# EAGLE design airball_display_board_v2 (EAGLE 9.6.2)
REV: 1

## Sheet 1 of 5
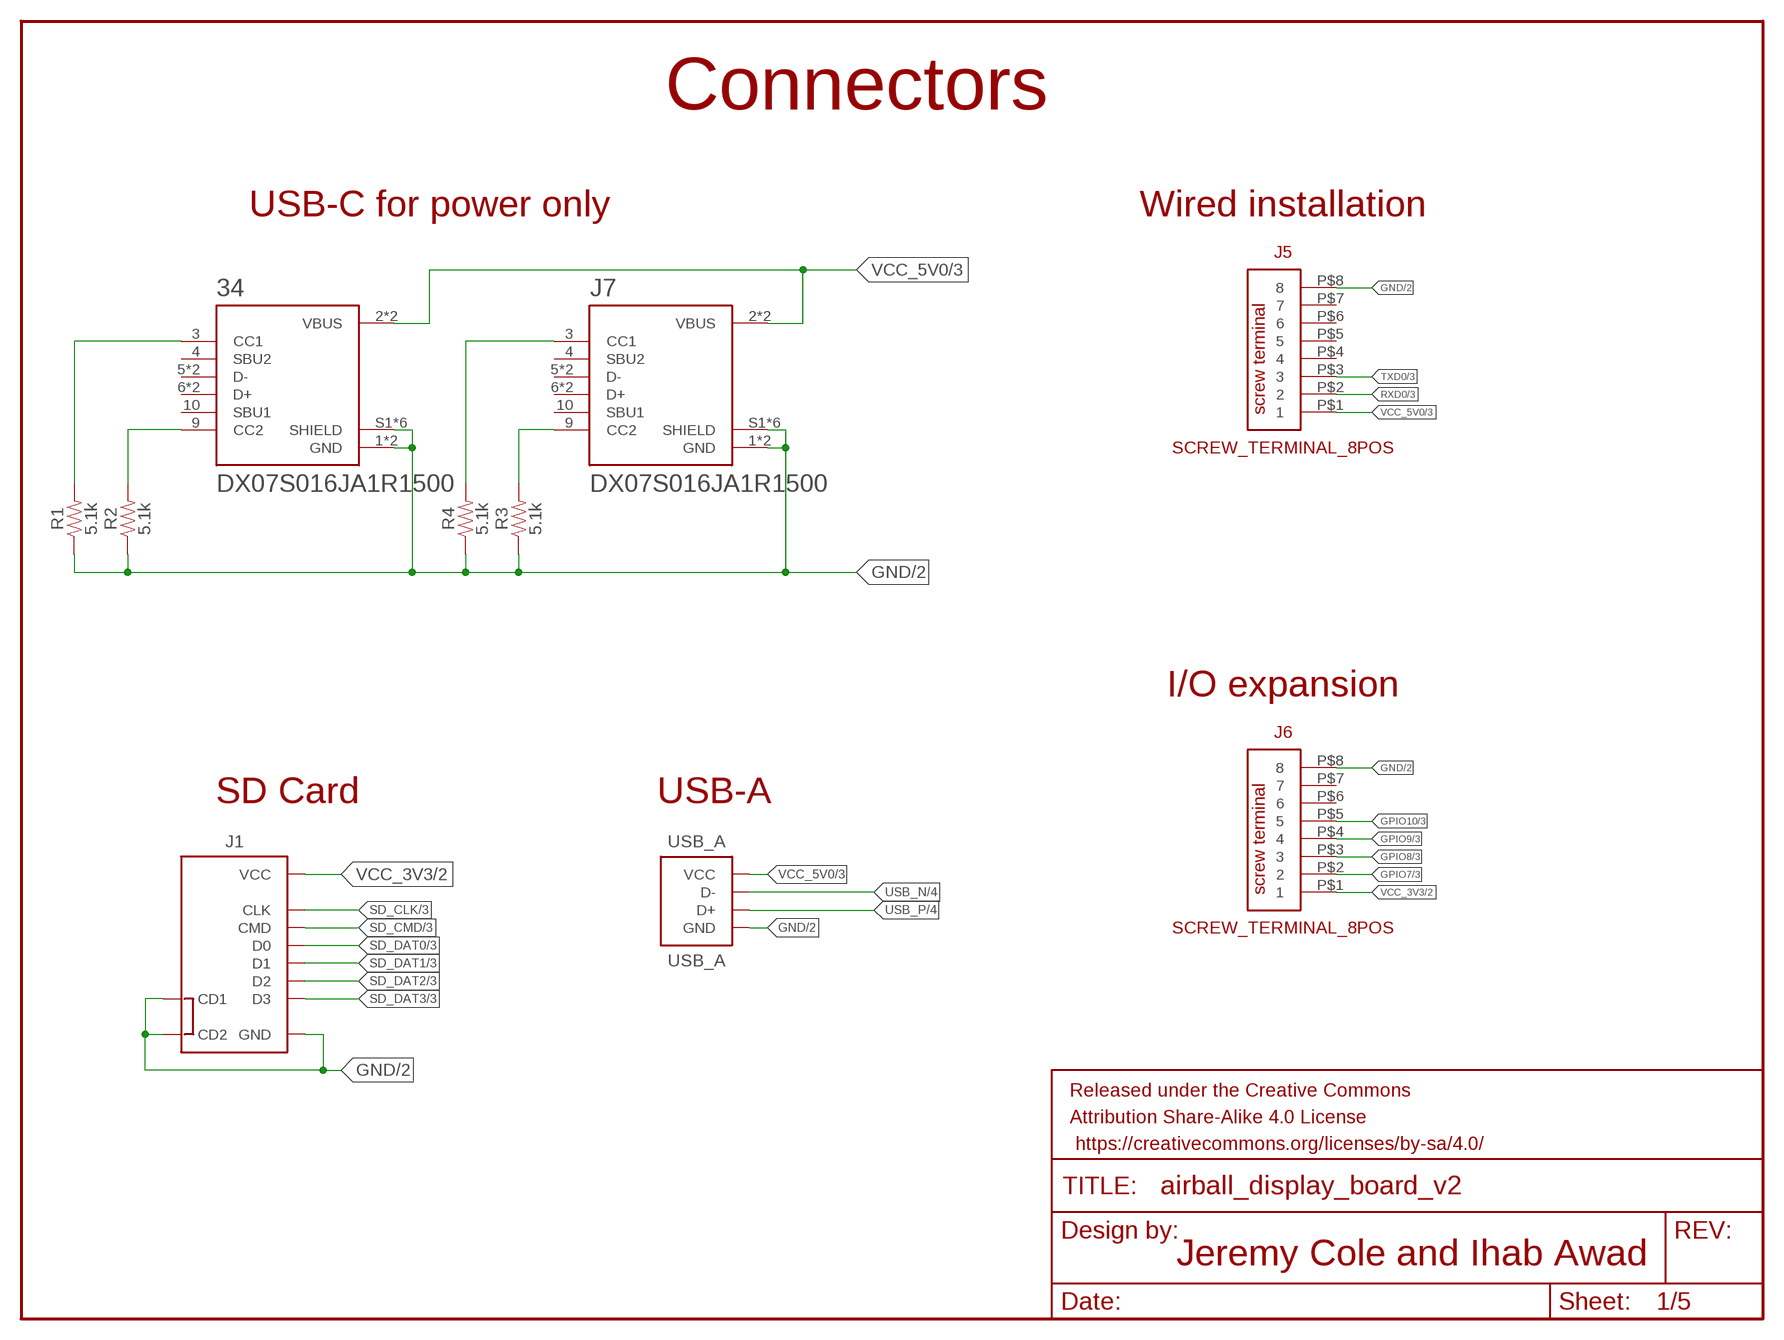
[diagram p0: schematic, sheet 1]

### Parts
34  DX07S016JA1R1500  [JAE_DX07S016JA1R1500]
FRAME1  FRAME-LETTER  [CREATIVE_COMMONS]
J1  MICRO-SD-SD4-MOLEX_104031  [MOLEX_MICRO_SD_104031]
J5  SCREW_TERMINAL_8POS  [SCREW_TERMINAL_8POS]
J6  SCREW_TERMINAL_8POS  [SCREW_TERMINAL_8POS]
J7  DX07S016JA1R1500  [JAE_DX07S016JA1R1500]
R1  5.1k  5.1KOHM5.1KOHM-0603-1/10W-1%  [0603]
R2  5.1k  5.1KOHM5.1KOHM-0603-1/10W-1%  [0603]
R3  5.1k  5.1KOHM5.1KOHM-0603-1/10W-1%  [0603]
R4  5.1k  5.1KOHM5.1KOHM-0603-1/10W-1%  [0603]
USB_A  USB_A  [FCI_USB_A_87583]

### Nets
GND: 34.1(GND) 34.12(GND) 34.S1(SHIELD) 34.S2(SHIELD) 34.S3(SHIELD) 34.S4(SHIELD) 34.S5(SHIELD) 34.S6(SHIELD) J1.6(GND) J1.CD1 J1.CD2 J1.SH@1(GND) J1.SH@2(GND) J1.SH@3(GND) J1.SH@4(GND) J5.P$8 J6.P$8 J7.1(GND) J7.12(GND) J7.S1(SHIELD) J7.S2(SHIELD) J7.S3(SHIELD) J7.S4(SHIELD) J7.S5(SHIELD) J7.S6(SHIELD) R1.1 R2.1 R3.1 R4.1 USB_A.GND USB_A.SH@1(GND) USB_A.SH@2(GND) ; also sheet 2,3,4,5
GPIO7: J6.P$2 ; also sheet 3
GPIO8: J6.P$3 ; also sheet 3
GPIO9: J6.P$4 ; also sheet 3
GPIO10: J6.P$5 ; also sheet 3
N$1: 34.9(CC2) R2.2
N$2: 34.3(CC1) R1.2
N$3: J7.9(CC2) R3.2
N$4: J7.3(CC1) R4.2
RXD0: J5.P$2 ; also sheet 3
SD_CLK: J1.5(CLK) ; also sheet 3
SD_CMD: J1.3(CMD) ; also sheet 3
SD_DAT0: J1.7(D0) ; also sheet 3
SD_DAT1: J1.8(D1) ; also sheet 3
SD_DAT2: J1.1(D2) ; also sheet 3
SD_DAT3: J1.2(D3) ; also sheet 3
TXD0: J5.P$3 ; also sheet 3
USB_N: USB_A.D- ; also sheet 4
USB_P: USB_A.D+ ; also sheet 4
VCC_3V3: J1.4(VCC) J6.P$1 ; also sheet 2,3,5
VCC_5V0 [vcc_5v0]: 34.2(VBUS) 34.11(VBUS) J5.P$1 J7.2(VBUS) J7.11(VBUS) USB_A.VBUS(VCC) ; also sheet 3,5
Unconnected: 34.4(SBU2) 34.5(D-) 34.6(D+) 34.7(D+) 34.8(D-) 34.10(SBU1) J5.P$4 J5.P$5 J5.P$6 J5.P$7 J6.P$6 J6.P$7 J7.4(SBU2) J7.5(D-) J7.6(D+) J7.7(D+) J7.8(D-) J7.10(SBU1)

### Notes on the sheet
- Connectors
- USB-C for power only | Wired installation
- I/O expansion
- SD Card | USB-A
- Jeremy Cole and Ihab Awad

## Sheet 2 of 5
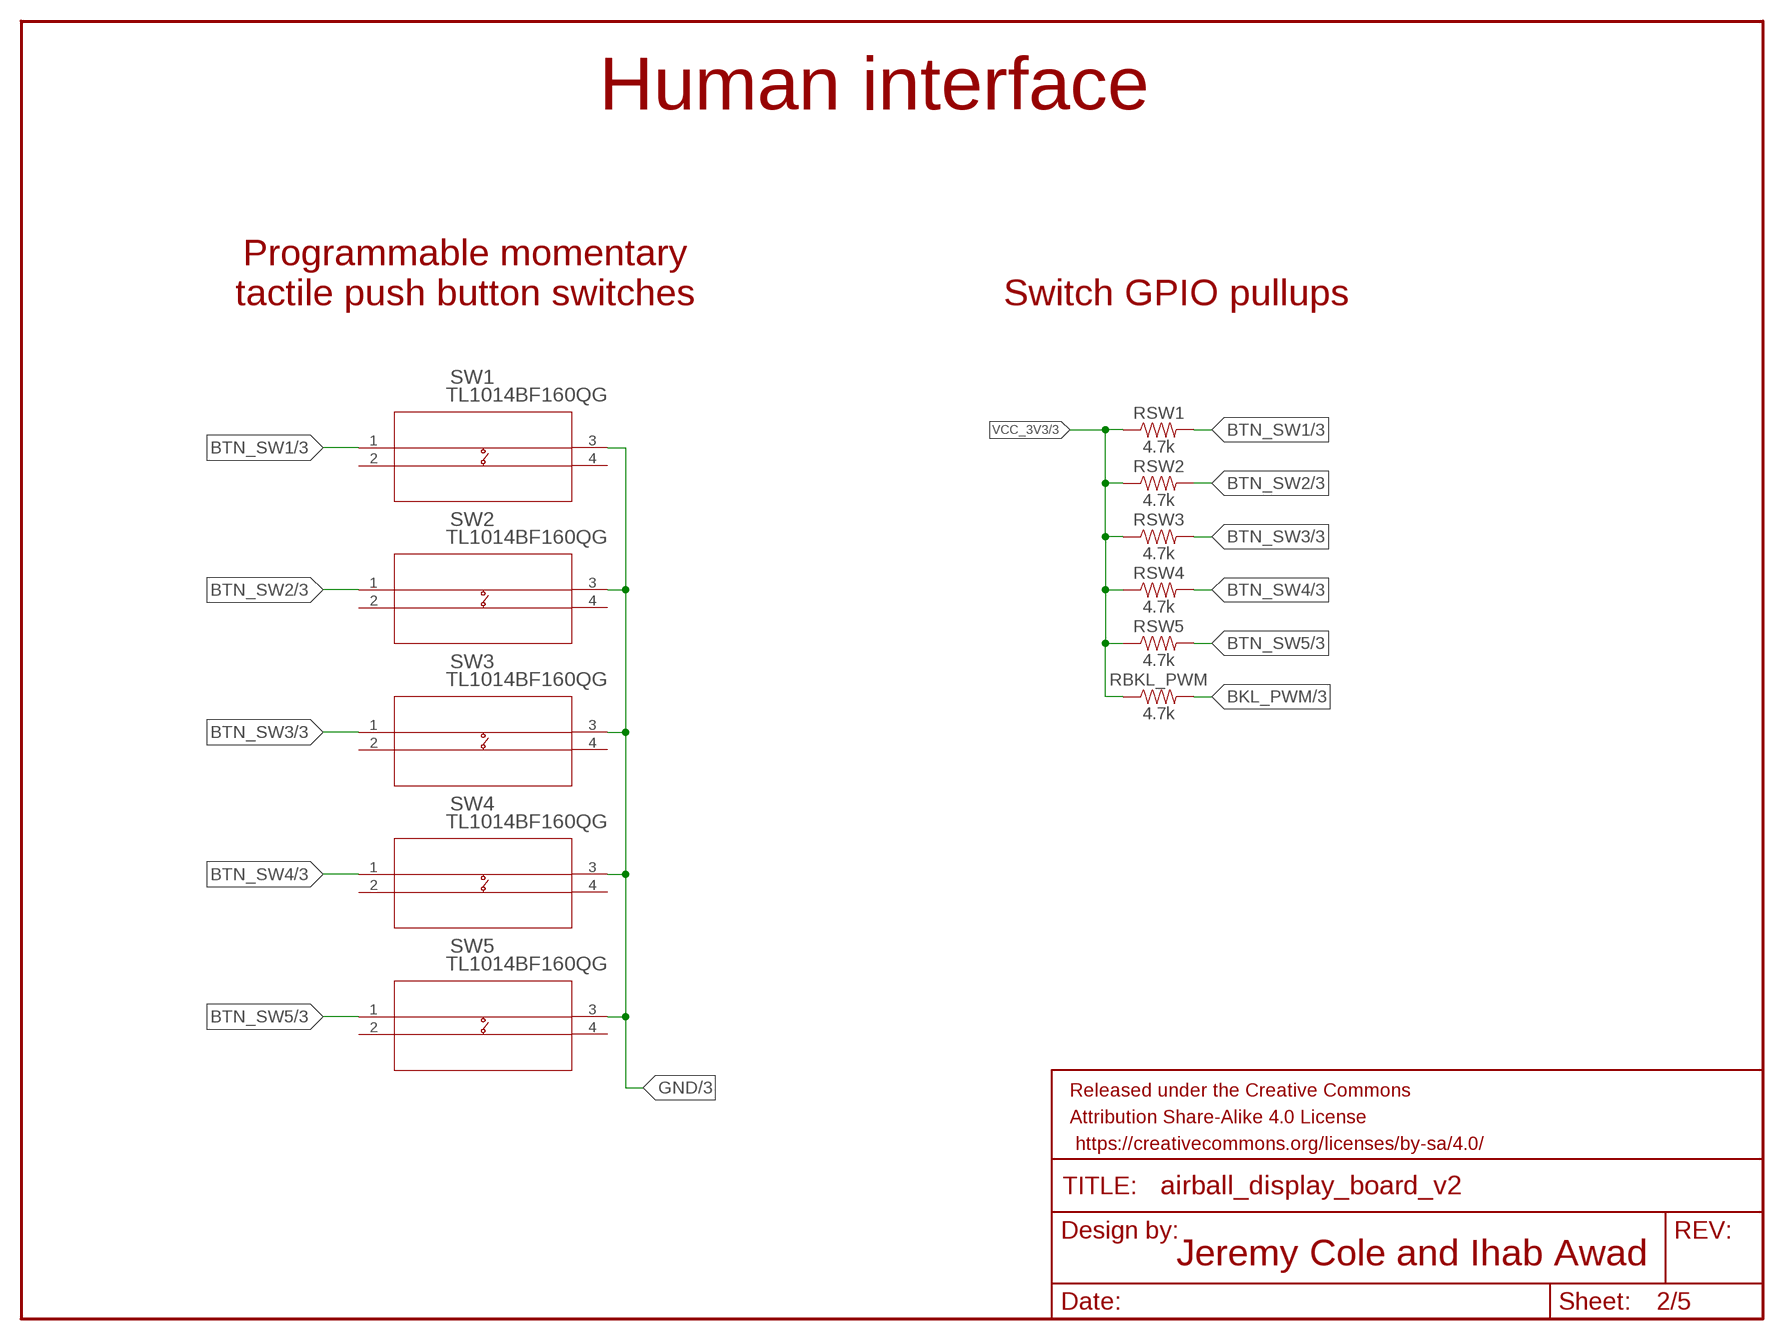
[diagram p1: schematic, sheet 2]

### Parts
FRAME4  FRAME-LETTER  [CREATIVE_COMMONS]
RBKL_PWM  4.7k  4.7KOHM-0603-1/10W-1%  [0603]
RSW1  4.7k  4.7KOHM-0603-1/10W-1%  [0603]
RSW2  4.7k  4.7KOHM-0603-1/10W-1%  [0603]
RSW3  4.7k  4.7KOHM-0603-1/10W-1%  [0603]
RSW4  4.7k  4.7KOHM-0603-1/10W-1%  [0603]
RSW5  4.7k  4.7KOHM-0603-1/10W-1%  [0603]
SW1  TL1014BF160QG  [TL1014BF160QG_EWI]
SW2  TL1014BF160QG  [TL1014BF160QG_EWI]
SW3  TL1014BF160QG  [TL1014BF160QG_EWI]
SW4  TL1014BF160QG  [TL1014BF160QG_EWI]
SW5  TL1014BF160QG  [TL1014BF160QG_EWI]

### Nets
BKL_PWM: RBKL_PWM.2 ; also sheet 3,5
BTN_SW1: RSW1.2 SW1.1 ; also sheet 3
BTN_SW2: RSW2.2 SW2.1 ; also sheet 3
BTN_SW3: RSW3.2 SW3.1 ; also sheet 3
BTN_SW4: RSW4.2 SW4.1 ; also sheet 3
BTN_SW5: RSW5.2 SW5.1 ; also sheet 3
GND: SW1.3 SW2.3 SW3.3 SW4.3 SW5.3 ; also sheet 1,3,4,5
VCC_3V3: RBKL_PWM.1 RSW1.1 RSW2.1 RSW3.1 RSW4.1 RSW5.1 ; also sheet 1,3,5
Unconnected: SW1.2 SW1.4 SW2.2 SW2.4 SW3.2 SW3.4 SW4.2 SW4.4 SW5.2 SW5.4

### Notes on the sheet
- Human interface
- Programmable momentary
  tactile push button switches
- Switch GPIO pullups
- Jeremy Cole and Ihab Awad

## Sheet 3 of 5
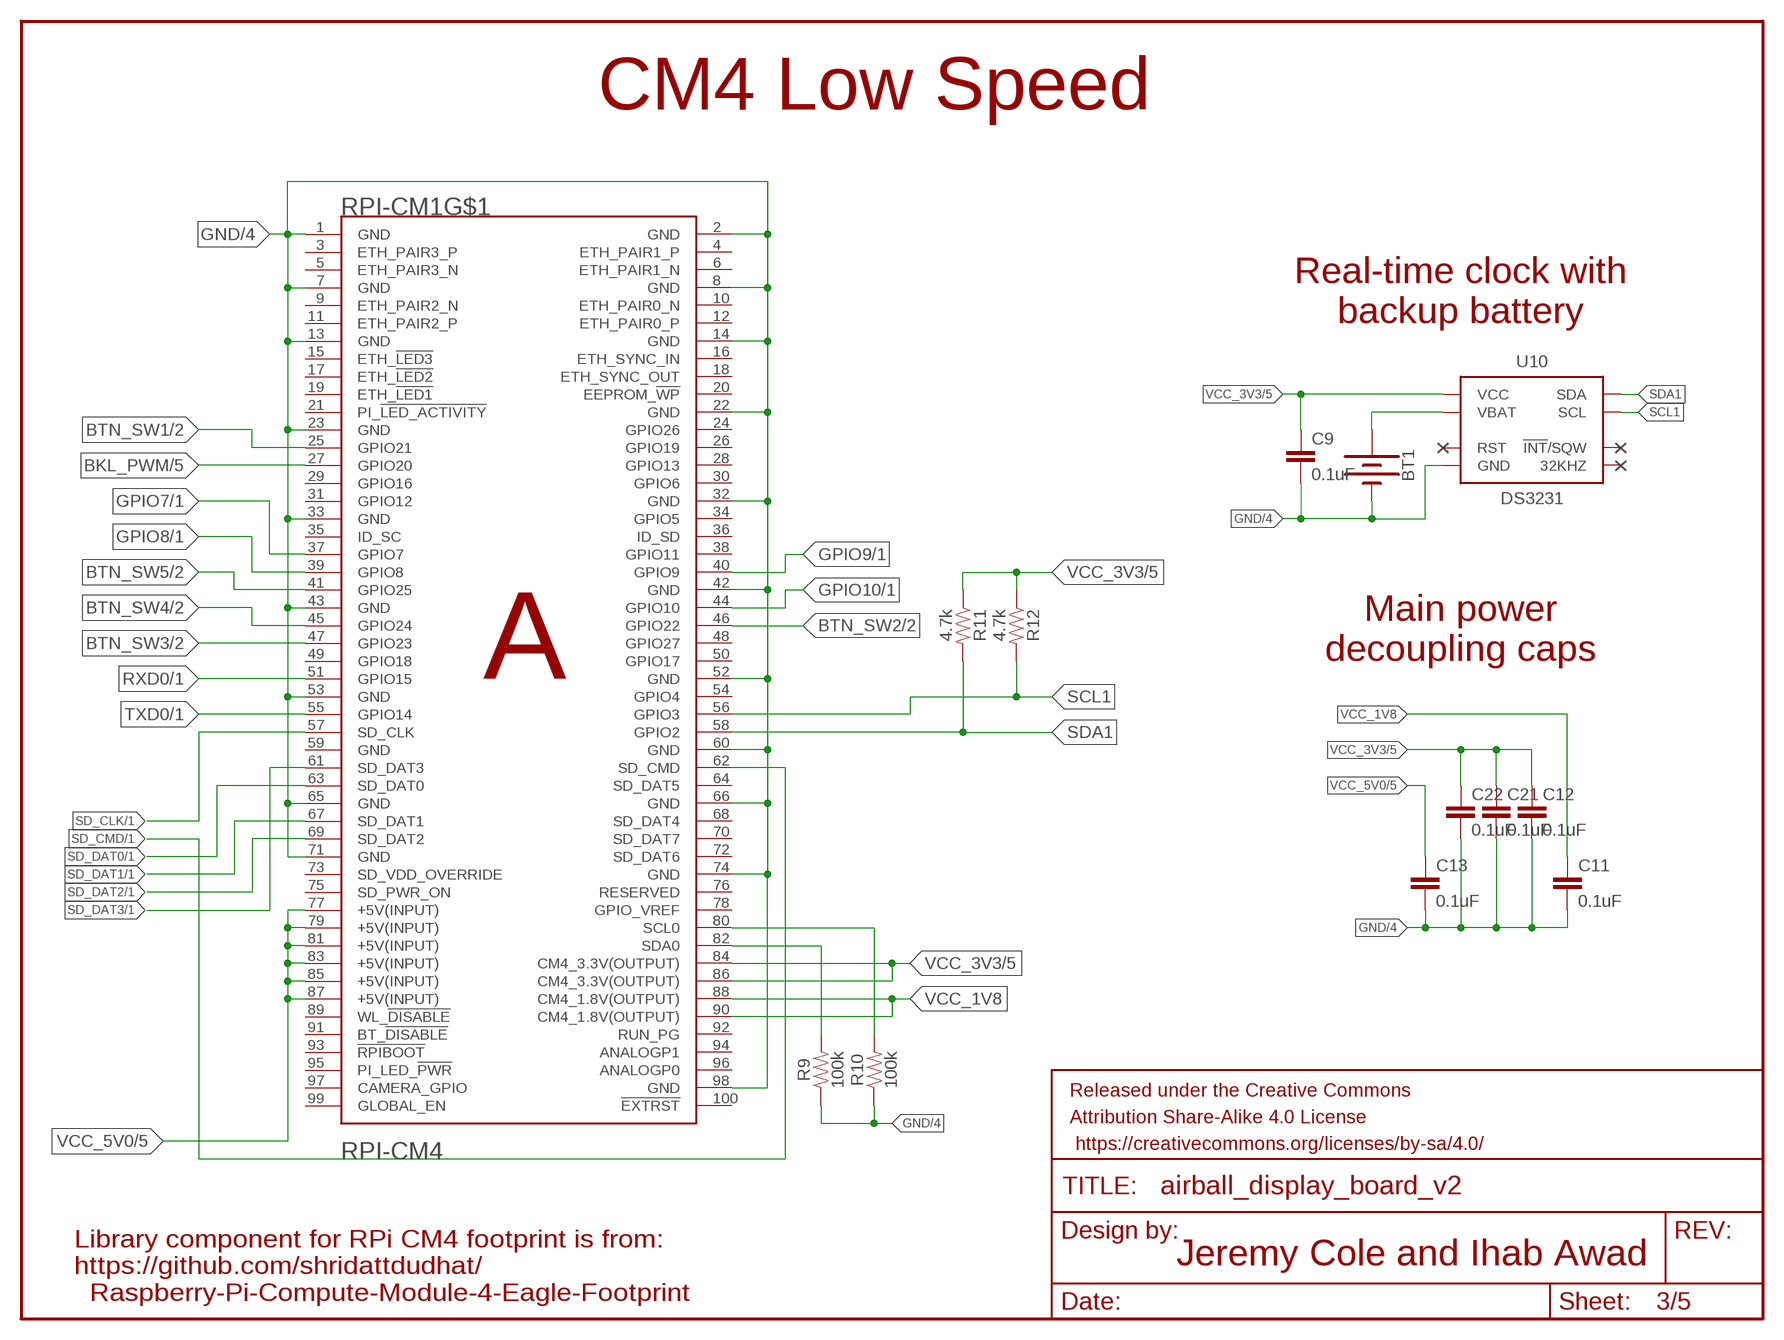
[diagram p2: schematic, sheet 3]

### Parts
BT1  BATTERY-12MM_SMD  [BATTCON_12MM]
C9  0.1uF  0.1UF-0603-25V-5%  [0603]
C11  0.1uF  0.1UF-0603-25V-5%  [0603]
C12  0.1uF  0.1UF-0603-25V-5%  [0603]
C13  0.1uF  0.1UF-0603-25V-5%  [0603]
C21  0.1uF  0.1UF-0603-25V-5%  [0603]
C22  0.1uF  0.1UF-0603-25V-5%  [0603]
FRAME2  FRAME-LETTER  [CREATIVE_COMMONS]
R9  100k  100KOHM-0603-1/10W-1%  [0603]
R10  100k  100KOHM-0603-1/10W-1%  [0603]
R11  4.7k  4.7KOHM-0603-1/10W-1%  [0603]
R12  4.7k  4.7KOHM-0603-1/10W-1%  [0603]
RPI-CM1  RPI-CM4  [RPI-CM4]
U10  DS3231  [SOIC16W]

### Nets
BKL_PWM: RPI-CM1.27(GPIO20) ; also sheet 2,5
BTN_SW1: RPI-CM1.25(GPIO21) ; also sheet 2
BTN_SW2: RPI-CM1.46(GPIO22) ; also sheet 2
BTN_SW3: RPI-CM1.47(GPIO23) ; also sheet 2
BTN_SW4: RPI-CM1.45(GPIO24) ; also sheet 2
BTN_SW5: RPI-CM1.41(GPIO25) ; also sheet 2
GND: BT1.GND(-) C9.2 C11.2 C12.2 C13.2 C21.2 C22.2 R9.1 R10.1 RPI-CM1.1(GND) RPI-CM1.2(GND) RPI-CM1.7(GND) RPI-CM1.8(GND) RPI-CM1.13(GND) RPI-CM1.14(GND) RPI-CM1.22(GND) RPI-CM1.23(GND) RPI-CM1.32(GND) RPI-CM1.33(GND) RPI-CM1.42(GND) RPI-CM1.43(GND) RPI-CM1.52(GND) RPI-CM1.53(GND) RPI-CM1.60(GND) RPI-CM1.65(GND) RPI-CM1.66(GND) RPI-CM1.71(GND) RPI-CM1.74(GND) RPI-CM1.98(GND) U10.5(GND) U10.6(GND) U10.7(GND) U10.8(GND) U10.9(GND) U10.10(GND) U10.11(GND) U10.12(GND) U10.13(GND) ; also sheet 1,2,4,5
GPIO7: RPI-CM1.37(GPIO7) ; also sheet 1
GPIO8: RPI-CM1.39(GPIO8) ; also sheet 1
GPIO9: RPI-CM1.40(GPIO9) ; also sheet 1
GPIO10: RPI-CM1.44(GPIO10) ; also sheet 1
RTC_VBAT: BT1.PWR@1(+) U10.14(VBAT)
RXD0: RPI-CM1.51(GPIO15) ; also sheet 1
SCL0: R10.2 RPI-CM1.80(SCL0)
SCL1: R12.2 RPI-CM1.56(GPIO3) U10.16(SCL)
SD_CLK: RPI-CM1.57(SD_CLK) ; also sheet 1
SD_CMD: RPI-CM1.62(SD_CMD) ; also sheet 1
SD_DAT0: RPI-CM1.63(SD_DAT0) ; also sheet 1
SD_DAT1: RPI-CM1.67(SD_DAT1) ; also sheet 1
SD_DAT2: RPI-CM1.69(SD_DAT2) ; also sheet 1
SD_DAT3: RPI-CM1.61(SD_DAT3) ; also sheet 1
SDA0: R9.2 RPI-CM1.82(SDA0)
SDA1: R11.2 RPI-CM1.58(GPIO2) U10.15(SDA)
TXD0: RPI-CM1.55(GPIO14) ; also sheet 1
VCC_1V8: C11.1 RPI-CM1.88(CM4_1.8V(OUTPUT)) RPI-CM1.90(CM4_1.8V(OUTPUT))
VCC_3V3: C9.1 C12.1 C21.1 C22.1 R11.1 R12.1 RPI-CM1.84(CM4_3.3V(OUTPUT)) RPI-CM1.86(CM4_3.3V(OUTPUT)) U10.2(VCC) ; also sheet 1,2,5
VCC_5V0 [vcc_5v0]: C13.1 RPI-CM1.77(+5V(INPUT)) RPI-CM1.79(+5V(INPUT)) RPI-CM1.81(+5V(INPUT)) RPI-CM1.83(+5V(INPUT)) RPI-CM1.85(+5V(INPUT)) RPI-CM1.87(+5V(INPUT)) ; also sheet 1,5
Unconnected: RPI-CM1.3(ETH_PAIR3_P) RPI-CM1.4(ETH_PAIR1_P) RPI-CM1.5(ETH_PAIR3_N) RPI-CM1.6(ETH_PAIR1_N) RPI-CM1.9(ETH_PAIR2_N) RPI-CM1.10(ETH_PAIR0_N) RPI-CM1.11(ETH_PAIR2_P) RPI-CM1.12(ETH_PAIR0_P) RPI-CM1.15(ETH_!LED3) RPI-CM1.16(ETH_SYNC_IN) RPI-CM1.17(ETH_!LED2) RPI-CM1.18(ETH_SYNC_OUT) RPI-CM1.19(ETH_!LED1) RPI-CM1.20(EEPROM_!WP) RPI-CM1.21(PI_!LED_ACTIVITY) RPI-CM1.24(GPIO26) RPI-CM1.26(GPIO19) RPI-CM1.28(GPIO13) RPI-CM1.29(GPIO16) RPI-CM1.30(GPIO6) RPI-CM1.31(GPIO12) RPI-CM1.34(GPIO5) RPI-CM1.35(ID_SC) RPI-CM1.36(ID_SD) RPI-CM1.38(GPIO11) RPI-CM1.48(GPIO27) RPI-CM1.49(GPIO18) RPI-CM1.50(GPIO17) RPI-CM1.54(GPIO4) RPI-CM1.59(GND) RPI-CM1.64(SD_DAT5) RPI-CM1.68(SD_DAT4) RPI-CM1.70(SD_DAT7) RPI-CM1.72(SD_DAT6) RPI-CM1.73(SD_VDD_OVERRIDE) RPI-CM1.75(SD_PWR_ON) RPI-CM1.76(RESERVED) RPI-CM1.78(GPIO_VREF) RPI-CM1.89(WL_!DISABLE) RPI-CM1.91(BT_!DISABLE) RPI-CM1.92(RUN_PG) RPI-CM1.93(!RPIBOOT) RPI-CM1.94(ANALOGP1) RPI-CM1.95(PI_LED_!PWR) RPI-CM1.96(ANALOGP0) RPI-CM1.97(CAMERA_GPIO) RPI-CM1.99(GLOBAL_EN) RPI-CM1.100(!EXTRST) U10.1(32KHZ) U10.3(!INT!/SQW) U10.4(RST)

### Notes on the sheet
- CM4 Low Speed
- Real-time clock with
  backup battery
- × | ×
- ×
- Main power
  decoupling caps
- Library component for RPi CM4 footprint is from:
  https://github.com/shridattdudhat/
    Raspberry-Pi-Compute-Module-4-Eagle-Footprint
- Jeremy Cole and Ihab Awad

## Sheet 4 of 5
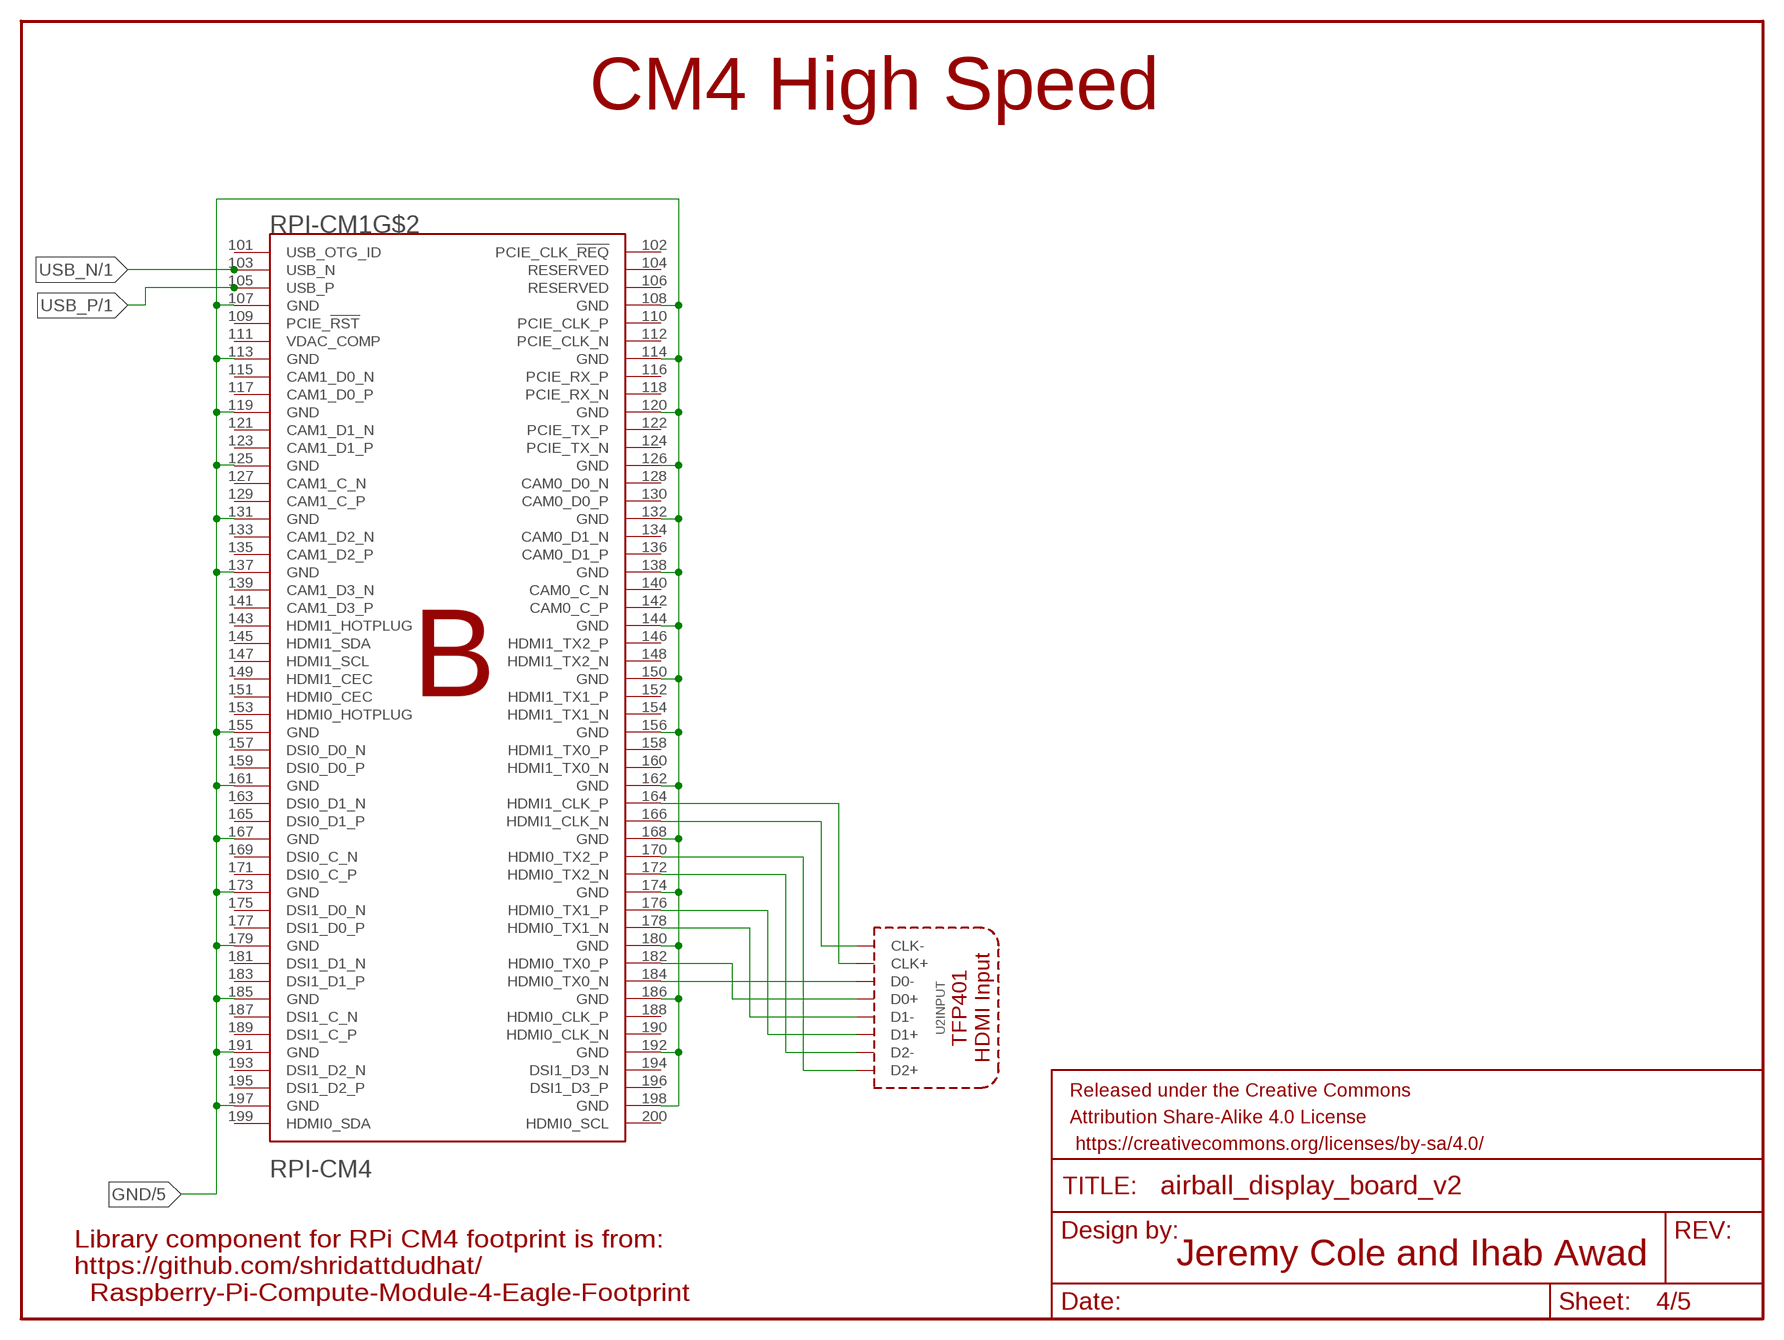
[diagram p3: schematic, sheet 4]

### Parts
FRAME3  FRAME-LETTER  [CREATIVE_COMMONS]
U2  TFP401A  TFP401-POWER_LITE  [TQFP100_POWER_LITE]

### Nets
GND: RPI-CM1.107(GND) RPI-CM1.108(GND) RPI-CM1.113(GND) RPI-CM1.114(GND) RPI-CM1.119(GND) RPI-CM1.120(GND) RPI-CM1.125(GND) RPI-CM1.126(GND) RPI-CM1.131(GND) RPI-CM1.132(GND) RPI-CM1.137(GND) RPI-CM1.138(GND) RPI-CM1.144(GND) RPI-CM1.150(GND) RPI-CM1.155(GND) RPI-CM1.156(GND) RPI-CM1.161(GND) RPI-CM1.162(GND) RPI-CM1.167(GND) RPI-CM1.168(GND) RPI-CM1.173(GND) RPI-CM1.174(GND) RPI-CM1.179(GND) RPI-CM1.180(GND) RPI-CM1.185(GND) RPI-CM1.186(GND) RPI-CM1.191(GND) RPI-CM1.192(GND) RPI-CM1.197(GND) RPI-CM1.198(GND) ; also sheet 1,2,3,5
N$8: RPI-CM1.184(HDMI0_TX0_N) U2.91(INPUT:D0-)
N$10: RPI-CM1.182(HDMI0_TX0_P) U2.90(INPUT:D0+)
N$11: RPI-CM1.178(HDMI0_TX1_N) U2.86(INPUT:D1-)
N$12: RPI-CM1.176(HDMI0_TX1_P) U2.85(INPUT:D1+)
N$13: RPI-CM1.172(HDMI0_TX2_N) U2.81(INPUT:D2-)
N$14: RPI-CM1.170(HDMI0_TX2_P) U2.80(INPUT:D2+)
N$15: RPI-CM1.166(HDMI1_CLK_N) U2.94(INPUT:CLK-)
N$16: RPI-CM1.164(HDMI1_CLK_P) U2.93(INPUT:CLK+)
USB_N: RPI-CM1.103(USB_N) ; also sheet 1
USB_P: RPI-CM1.105(USB_P) ; also sheet 1
Unconnected: RPI-CM1.101(USB_OTG_ID) RPI-CM1.102(PCIE_CLK_!REQ) RPI-CM1.104(RESERVED) RPI-CM1.106(RESERVED) RPI-CM1.109(PCIE_!RST) RPI-CM1.110(PCIE_CLK_P) RPI-CM1.111(VDAC_COMP) RPI-CM1.112(PCIE_CLK_N) RPI-CM1.115(CAM1_D0_N) RPI-CM1.116(PCIE_RX_P) RPI-CM1.117(CAM1_D0_P) RPI-CM1.118(PCIE_RX_N) RPI-CM1.121(CAM1_D1_N) RPI-CM1.122(PCIE_TX_P) RPI-CM1.123(CAM1_D1_P) RPI-CM1.124(PCIE_TX_N) RPI-CM1.127(CAM1_C_N) RPI-CM1.128(CAM0_D0_N) RPI-CM1.129(CAM1_C_P) RPI-CM1.130(CAM0_D0_P) RPI-CM1.133(CAM1_D2_N) RPI-CM1.134(CAM0_D1_N) RPI-CM1.135(CAM1_D2_P) RPI-CM1.136(CAM0_D1_P) RPI-CM1.139(CAM1_D3_N) RPI-CM1.140(CAM0_C_N) RPI-CM1.141(CAM1_D3_P) RPI-CM1.142(CAM0_C_P) RPI-CM1.143(HDMI1_HOTPLUG) RPI-CM1.145(HDMI1_SDA) RPI-CM1.146(HDMI1_TX2_P) RPI-CM1.147(HDMI1_SCL) RPI-CM1.148(HDMI1_TX2_N) RPI-CM1.149(HDMI1_CEC) RPI-CM1.151(HDMI0_CEC) RPI-CM1.152(HDMI1_TX1_P) RPI-CM1.153(HDMI0_HOTPLUG) RPI-CM1.154(HDMI1_TX1_N) RPI-CM1.157(DSI0_D0_N) RPI-CM1.158(HDMI1_TX0_P) RPI-CM1.159(DSI0_D0_P) RPI-CM1.160(HDMI1_TX0_N) RPI-CM1.163(DSI0_D1_N) RPI-CM1.165(DSI0_D1_P) RPI-CM1.169(DSI0_C_N) RPI-CM1.171(DSI0_C_P) RPI-CM1.175(DSI1_D0_N) RPI-CM1.177(DSI1_D0_P) RPI-CM1.181(DSI1_D1_N) RPI-CM1.183(DSI1_D1_P) RPI-CM1.187(DSI1_C_N) RPI-CM1.188(HDMI0_CLK_P) RPI-CM1.189(DSI1_C_P) RPI-CM1.190(HDMI0_CLK_N) RPI-CM1.193(DSI1_D2_N) RPI-CM1.194(DSI1_D3_N) RPI-CM1.195(DSI1_D2_P) RPI-CM1.196(DSI1_D3_P) RPI-CM1.199(HDMI0_SDA) RPI-CM1.200(HDMI0_SCL) U2.49(ODD:QB0) U2.50(ODD:QB1) U2.51(ODD:QB2) U2.52(ODD:QB3) U2.53(ODD:QB4) U2.54(ODD:QB5) U2.55(ODD:QB6) U2.56(ODD:QB7) U2.59(ODD:QG0) U2.60(ODD:QG1) U2.61(ODD:QG2) U2.62(ODD:QG3) U2.63(ODD:QG4) U2.64(ODD:QG5) U2.65(ODD:QG6) U2.66(ODD:QG7) U2.69(ODD:QR0) U2.70(ODD:QR1) U2.71(ODD:QR2) U2.72(ODD:QR3) U2.73(ODD:QR4) U2.74(ODD:QR5) U2.75(ODD:QR6) U2.77(ODD:QR7)

### Notes on the sheet
- CM4 High Speed
- Library component for RPi CM4 footprint is from:
  https://github.com/shridattdudhat/
    Raspberry-Pi-Compute-Module-4-Eagle-Footprint
- Jeremy Cole and Ihab Awad

## Sheet 5 of 5
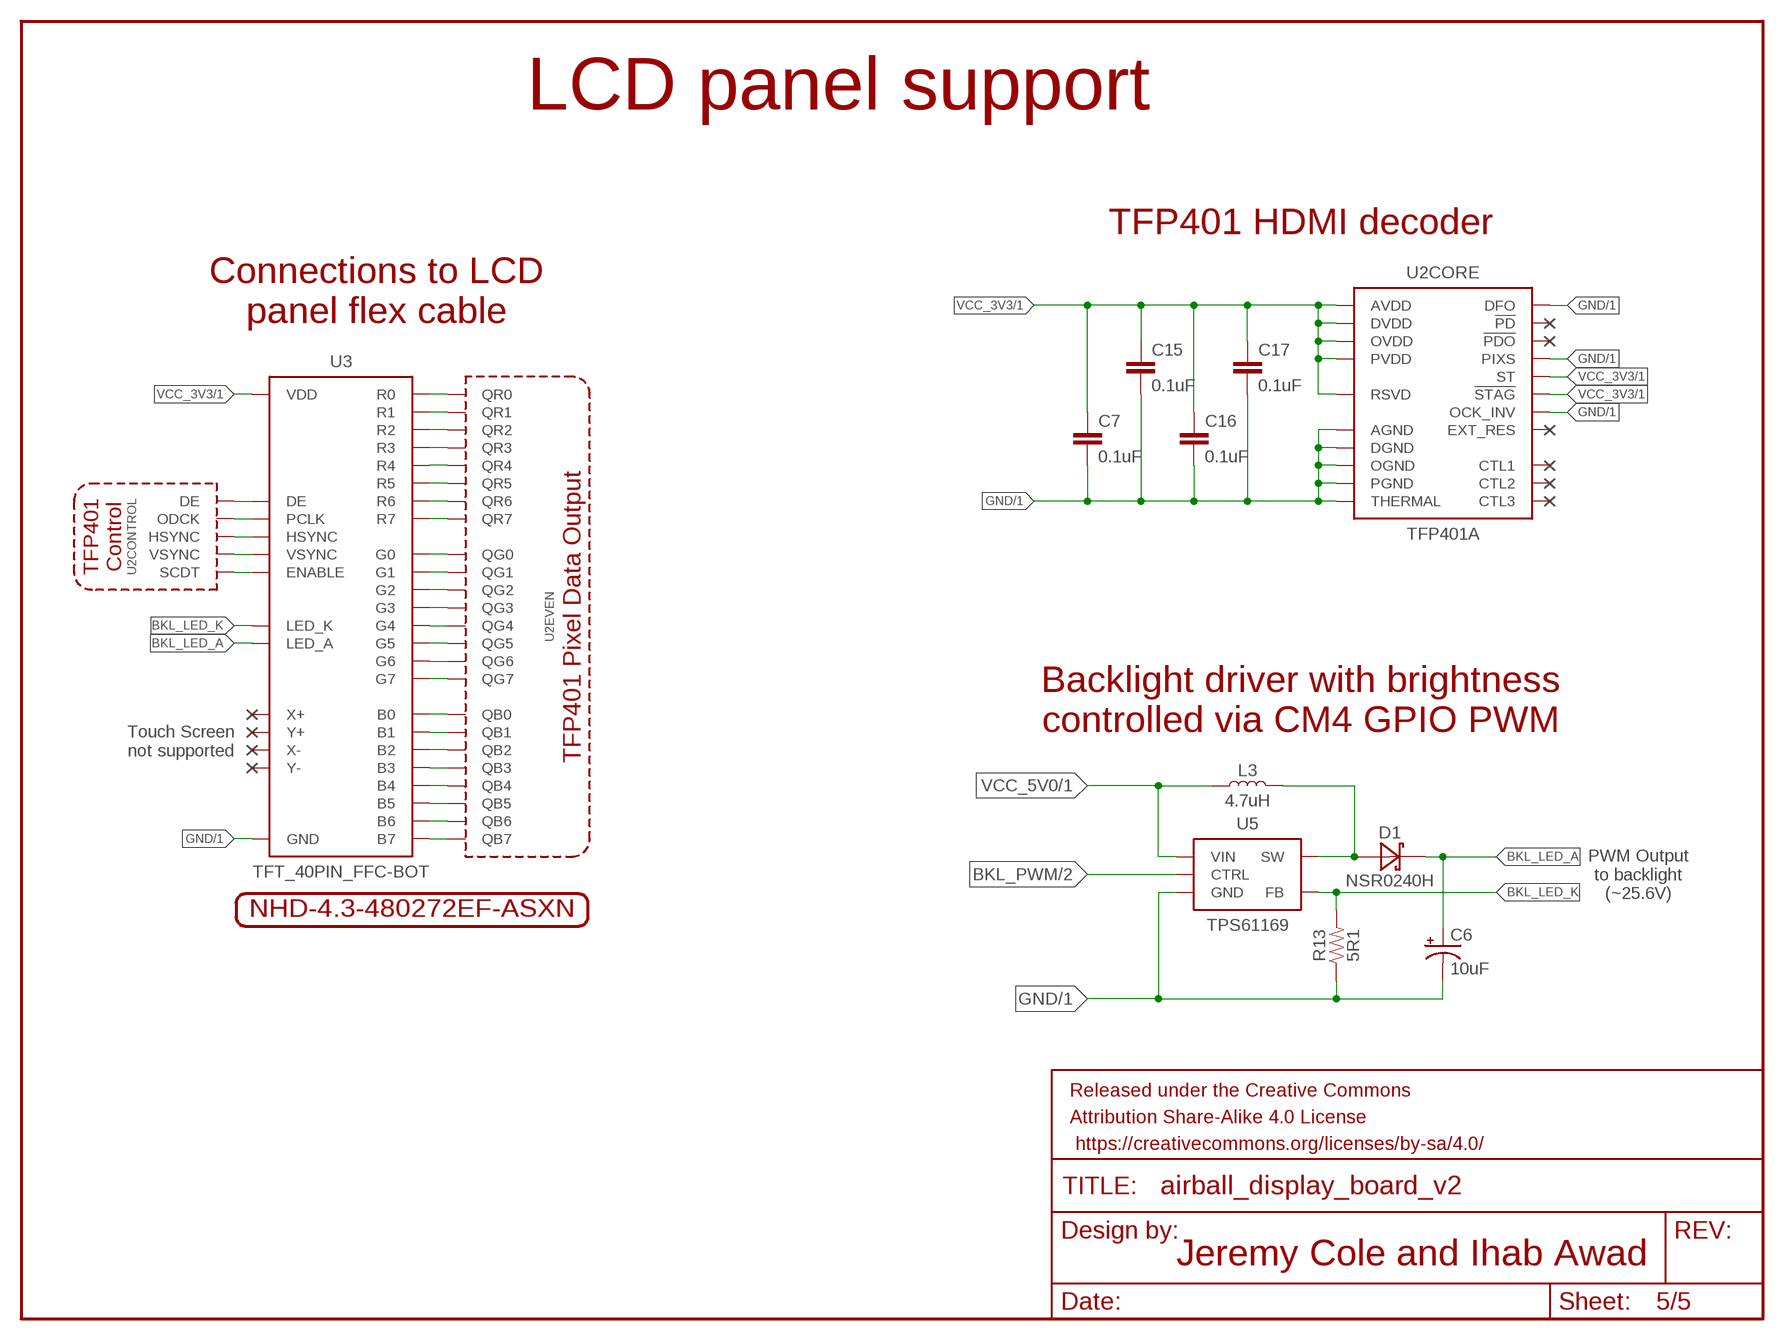
[diagram p4: schematic, sheet 5]

### Parts
C6  10uF  10UF-POLAR-EIA3216-16V-10%(TANT)  [EIA3216]
C7  0.1uF  0.1UF-0603-25V-5%  [0603]
C15  0.1uF  0.1UF-0603-25V-5%  [0603]
C16  0.1uF  0.1UF-0603-25V-5%  [0603]
C17  0.1uF  0.1UF-0603-25V-5%  [0603]
D1  NSR0240H  DIODE-SCHOTTKY-SOD323  [SOD323]
FRAME5  FRAME-LETTER  [CREATIVE_COMMONS]
L3  4.7uH  INDUCTOR-SMD_4X4  [INDUCTOR_SMD_4X4MM]
R13  5R1  RESISTOR0603  [0603]
U3  TFT_40PIN_FFC-BOT  [HIROSE_FFC40_FH12-40S-0.5SH]
U5  TPS61169  [SOT353-5]
U$4  NHD-4.3-480272EF-ASXN  [NHD-4.3-480272EF-ASXN]

### Nets
B0: U2.10(EVEN:QB0) U3.21(B0)
B1: U2.11(EVEN:QB1) U3.22(B1)
B2: U2.12(EVEN:QB2) U3.23(B2)
B3: U2.13(EVEN:QB3) U3.24(B3)
B4: U2.14(EVEN:QB4) U3.25(B4)
B5: U2.15(EVEN:QB5) U3.26(B5)
B6: U2.16(EVEN:QB6) U3.27(B6)
B7: U2.17(EVEN:QB7) U3.28(B7)
BKL_LED_A: C6.+ D1.K(C) U3.2(LED_A)
BKL_LED_K: R13.2 U3.1(LED_K) U5.3(FB)
BKL_PWM: U5.4(CTRL) ; also sheet 2,3
DE: U2.46(CONTROL:DE) U3.34(DE)
G0: U2.20(EVEN:QG0) U3.13(G0)
G1: U2.21(EVEN:QG1) U3.14(G1)
G2: U2.22(EVEN:QG2) U3.15(G2)
G3: U2.23(EVEN:QG3) U3.16(G3)
G4: U2.24(EVEN:QG4) U3.17(G4)
G5: U2.25(EVEN:QG5) U3.18(G5)
G6: U2.26(EVEN:QG6) U3.19(G6)
G7: U2.27(EVEN:QG7) U3.20(G7)
GND: C6.- C7.2 C15.2 C16.2 C17.2 R13.1 U2.1(CORE:DFO) U2.4(CORE:PIXS) U2.5(CORE:DGND) U2.19(CORE:OGND) U2.28(CORE:OGND) U2.39(CORE:DGND) U2.45(CORE:OGND) U2.58(CORE:OGND) U2.68(CORE:DGND) U2.76(CORE:OGND) U2.79(CORE:AGND) U2.83(CORE:AGND) U2.87(CORE:AGND) U2.89(CORE:AGND) U2.92(CORE:AGND) U2.98(CORE:PGND) U2.100(CORE:OCK_INV) U2.TH21(CORE:THERMAL) U2.TH22(CORE:THERMAL) U2.TH23(CORE:THERMAL) U2.TH24(CORE:THERMAL) U2.TH25(CORE:THERMAL) U2.TH30(CORE:THERMAL) U2.TH34(CORE:THERMAL) U2.TH39(CORE:THERMAL) U2.TH43(CORE:THERMAL) U2.TH48(CORE:THERMAL) U2.TH52(CORE:THERMAL) U2.TH57(CORE:THERMAL) U2.TH58(CORE:THERMAL) U2.TH59(CORE:THERMAL) U2.TH60(CORE:THERMAL) U2.TH61(CORE:THERMAL) U2.THA(CORE:THERMAL) U2.THB(CORE:THERMAL) U3.3(GND) U3.29(GND) U3.36(GND) U5.2(GND) ; also sheet 1,2,3,4
HSYNC: U2.48(CONTROL:HSYNC) U3.32(HSYNC)
L_BKL: D1.A L3.2 U5.1(SW)
PCLK: U2.44(CONTROL:ODCK) U3.30(PCLK)
R0: U2.30(EVEN:QR0) U3.5(R0)
R1: U2.31(EVEN:QR1) U3.6(R1)
R2: U2.32(EVEN:QR2) U3.7(R2)
R3: U2.33(EVEN:QR3) U3.8(R3)
R4: U2.34(EVEN:QR4) U3.9(R4)
R5: U2.35(EVEN:QR5) U3.10(R5)
R6: U2.36(EVEN:QR6) U3.11(R6)
R7: U2.37(EVEN:QR7) U3.12(R7)
SCDT: U2.8(CONTROL:SCDT) U3.31(ENABLE)
VCC_3V3: C7.1 C15.1 C16.1 C17.1 U2.3(CORE:ST) U2.6(CORE:DVDD) U2.7(CORE:!STAG) U2.18(CORE:OVDD) U2.29(CORE:OVDD) U2.38(CORE:DVDD) U2.43(CORE:OVDD) U2.57(CORE:OVDD) U2.67(CORE:DVDD) U2.78(CORE:OVDD) U2.82(CORE:AVDD) U2.84(CORE:AVDD) U2.88(CORE:AVDD) U2.95(CORE:AVDD) U2.97(CORE:PVDD) U2.99(CORE:RSVD) U3.4(VDD) ; also sheet 1,2,3
VCC_5V0 [vcc_5v0]: L3.1 U5.5(VIN) ; also sheet 1,3
VSYNC: U2.47(CONTROL:VSYNC) U3.33(VSYNC)
Unconnected: U2.2(CORE:!PD) U2.9(CORE:!PDO) U2.40(CORE:CTL1) U2.41(CORE:CTL2) U2.42(CORE:CTL3) U2.96(CORE:EXT_RES) U3.37(X+) U3.38(Y+) U3.39(X-) U3.40(Y-)

### Notes on the sheet
- LCD panel support
- TFP401 HDMI decoder
- Connections to LCD
  panel flex cable
- ×
- ×
- ×
- ×
- ×
- ×
- ×
- ×
- Backlight driver with brightness
  controlled via CM4 GPIO PWM
- Touch Screen
  not supported
- ×
- ×
- PWM Output
  to backlight
  (~25.6V)
- Jeremy Cole and Ihab Awad

## Library data of the parts
34 J7 = airball:DX07S016JA1R1500: USB-C (USB TYPE-C) USB 2.0 Receptacle Connector 24 (16+8 Dummy) Position Surface Mount, Right Angle; Through Hole; DESCRIPTION: USB-C (USB TYPE-C) USB 2.0 Receptacle Connector 24 (16+8 Dummy) Position Surface Mount, Right Angle; Through Hole; DIGI-KEY_PART_NUMBER: 670-DX07S016JA1R1500CT-ND; MF: JAE Electronics; MP: DX07S016JA1R1500; PACKAGE: None; PURCHASE-URL: https://pricing.snapeda.com/search/part/DX07S016JA1R1500/?ref=eda
BT1 = SparkFun-Batteries:BATTERY: Battery - Single Cell A variety of battery chemistries, sizes, and footprints. Device List: 20MM_PTH - Coin Cell Battery Holder - 20mm (PTH) <https://www.sparkfun.com/products/783> 6.8MM_PTH - Coin Cell Battery Holder - 6.8MM(SMD) <https://www.digikey.com/product-detail/en/seiko-instruments/MS621FE-FL11E/728-1057-ND/1889208?WT.srch=1&gclid=CNOQ5a6LzdQCFZS2wAodXCkE0g> 12MM_SMD - Coin Cell Battery Holder - 12mm (SMD) <https://www.sparkfun.com/products/10592> 12MM_PTH - Coin Cell Battery Holder - 12mm (PTH) <https://www.sparkfun.com/products/7948> 20MM_SMD - 20mm Coin Cell Battery Holder (SMD) (2 legs) Used on the Big Time Watch Kit <https://www.sparkfun.com/products/11734> 20MM_SMD_4LEGS - Coin Cell Battery Holder - 20mm (SMD) <https://www.sparkfun.com/products/11892> 20MM_SMD_4LEGS_OVERPASTE - Coin Cell Battery Holder - 20mm (SMD) <https://www.sparkfun.com/products/11892> (Over-paste on the legs) 24.5MM_PTH - Coin Cell Battery Holder - 24.5mm (PTH) <https://www.sparkfun.com/products/8863> 9V - 9V Battery Holder - PC Mount Used on the SparkFun SparkPunk Sound Kit <https://www.sparkfun.com/products/11177> and SparkFun SparkPunk Sequencer Kit <https://www.sparkfun.com/products/12707> 18650 - Battery Holder - 18650 (PTH) <https://www.sparkfun.com/products/13113> AA - Battery Holder - 1xAA (PTH) <https://www.sparkfun.com/products/7949> AAA - Battery Holder - 1xAAA (PTH) <https://www.sparkfun.com/products/12718> AA_KIT - Battery Holder - 1xAA (PTH) <https://www.sparkfun.com/products/7949> Special kit package - pads only have exposed copper on one side of the board. AAA_KIT - Battery Holder - 1xAAA (PTH) <https://www.sparkfun.com/products/12718> Special kit package - pads only have exposed copper on one side of the board.; PROD_ID: BATT-08044; SF_SKU: PRT-10592
C6 = SparkFun-Capacitors:10UF-POLAR: 10.0µF polarized capacitors A capacitor is a passive two-terminal electrical component used to store electrical energy temporarily in an electric field.; PROD_ID: CAP-00811
C7 C9 C11-C13 C15-C17 C21 C22 = SparkFun-Capacitors:0.1UF: 0.1µF ceramic capacitors A capacitor is a passive two-terminal electrical component used to store electrical energy temporarily in an electric field.; PROD_ID: CAP-08604
D1 = airball:DIODE-SCHOTTKY
FRAME1-FRAME5 = SparkFun-Aesthetics:FRAME-LETTER: Schematic Frame - Letter Standard 8.5x11 US Letter frame
J1 = airball:MICRO-SD-SD4
J5 J6 = airball:SCREW_TERMINAL_8POS
L3 = airball:INDUCTOR
R1-R4 = SparkFun-Resistors:5.1KOHM; PROD_ID: RES-12083
R9 R10 = SparkFun-Resistors:100KOHM: 100kΩ resistor A resistor is a passive two-terminal electrical component that implements electrical resistance as a circuit element. Resistors act to reduce current flow, and, at the same time, act to lower voltage levels within circuits. - Wikipedia; PROD_ID: RES-07828
R11 R12 RBKL_PWM RSW1-RSW5 = SparkFun-Resistors:4.7KOHM: 4.7kΩ resistor A resistor is a passive two-terminal electrical component that implements electrical resistance as a circuit element. Resistors act to reduce current flow, and, at the same time, act to lower voltage levels within circuits. - Wikipedia; PROD_ID: RES-07857
R13 = SparkFun-Resistors:RESISTOR: Generic Resistor Package
RPI-CM1 = RPI-CM4:RPI-CM4
SW1-SW5 = airball:TL1014BF160QG; BUILT_BY: EMA_Cory; COPYRIGHT: Copyright (C) 2018 Accelerated Designs. All rights reserved; DATASHEET: http://spec_sheets.e-switch.com/specs/P410002.pdf; MANUFACTURER_PART_NUMBER: TL1014BF160QG; SOURCELIBRARY: E-Switch_2020-04-21; VENDOR: E-Switch
U2 = airball:TFP401
U3 = airball:TFT_40PIN_FFC
U5 = airball:TPS61169
U10 = airball:DS3231
U$4 = airball:NHD-4.3-480272EF-ASXN
USB_A = airball:USB_A

## Net classes
0 default: clearance 0.1 mm
1 power: width 0.305 mm

## Board
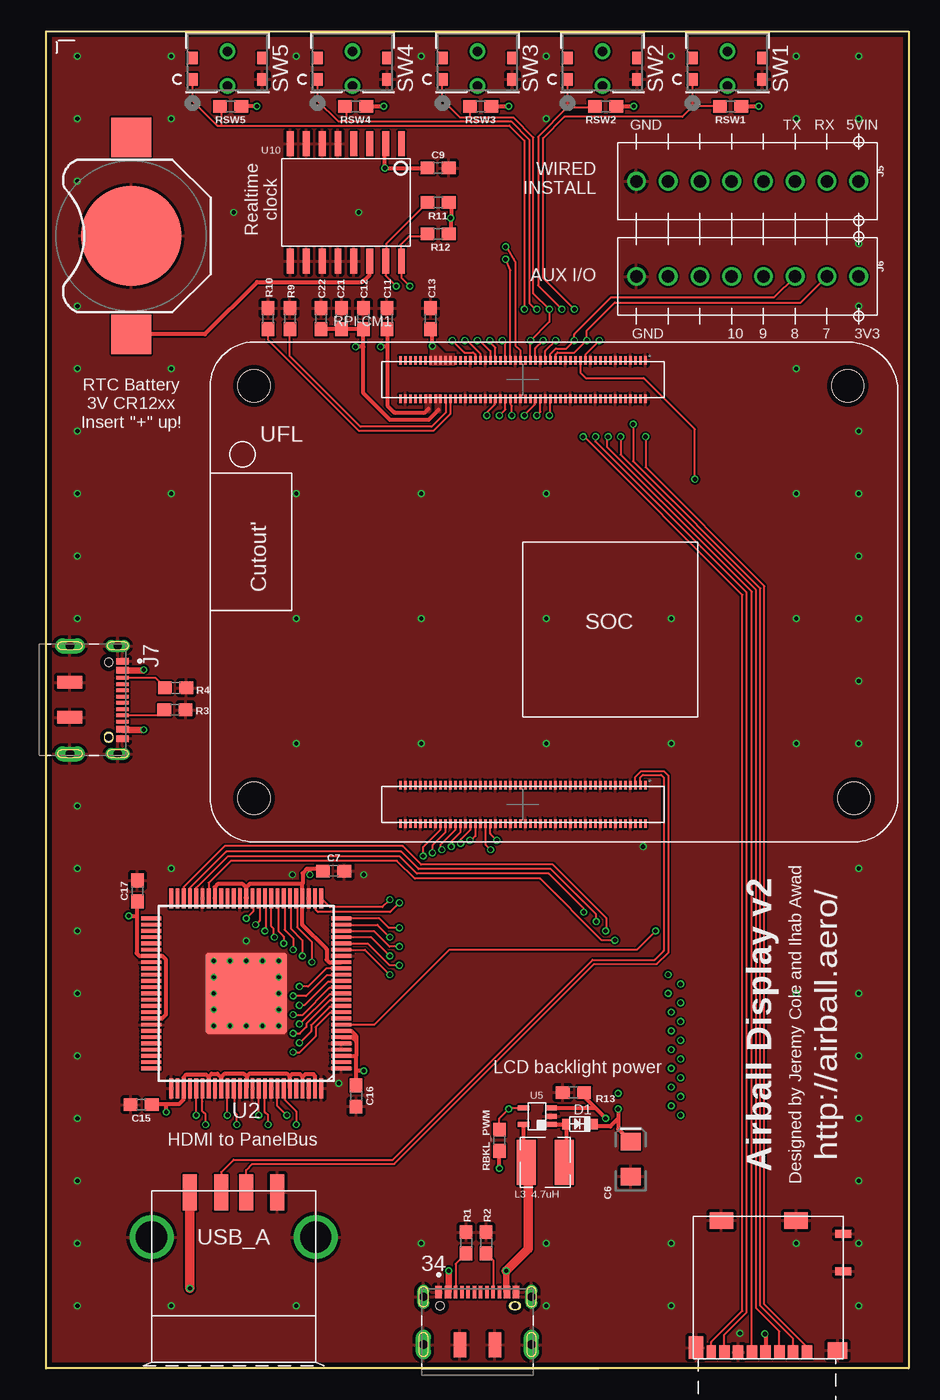
[diagram p5: board, top side]
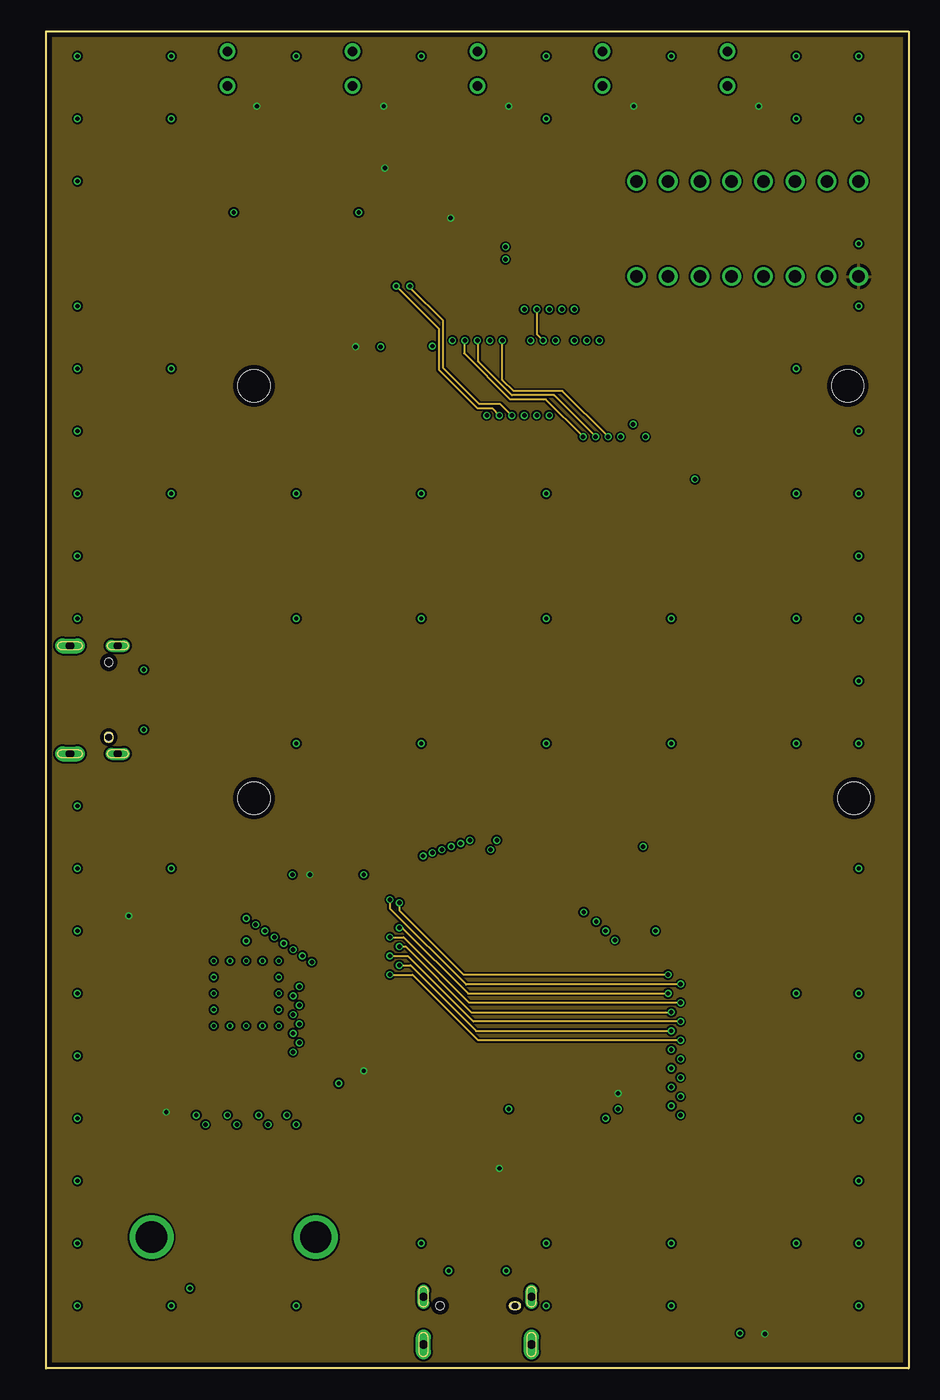
[diagram p6: board, inner layer Route2]
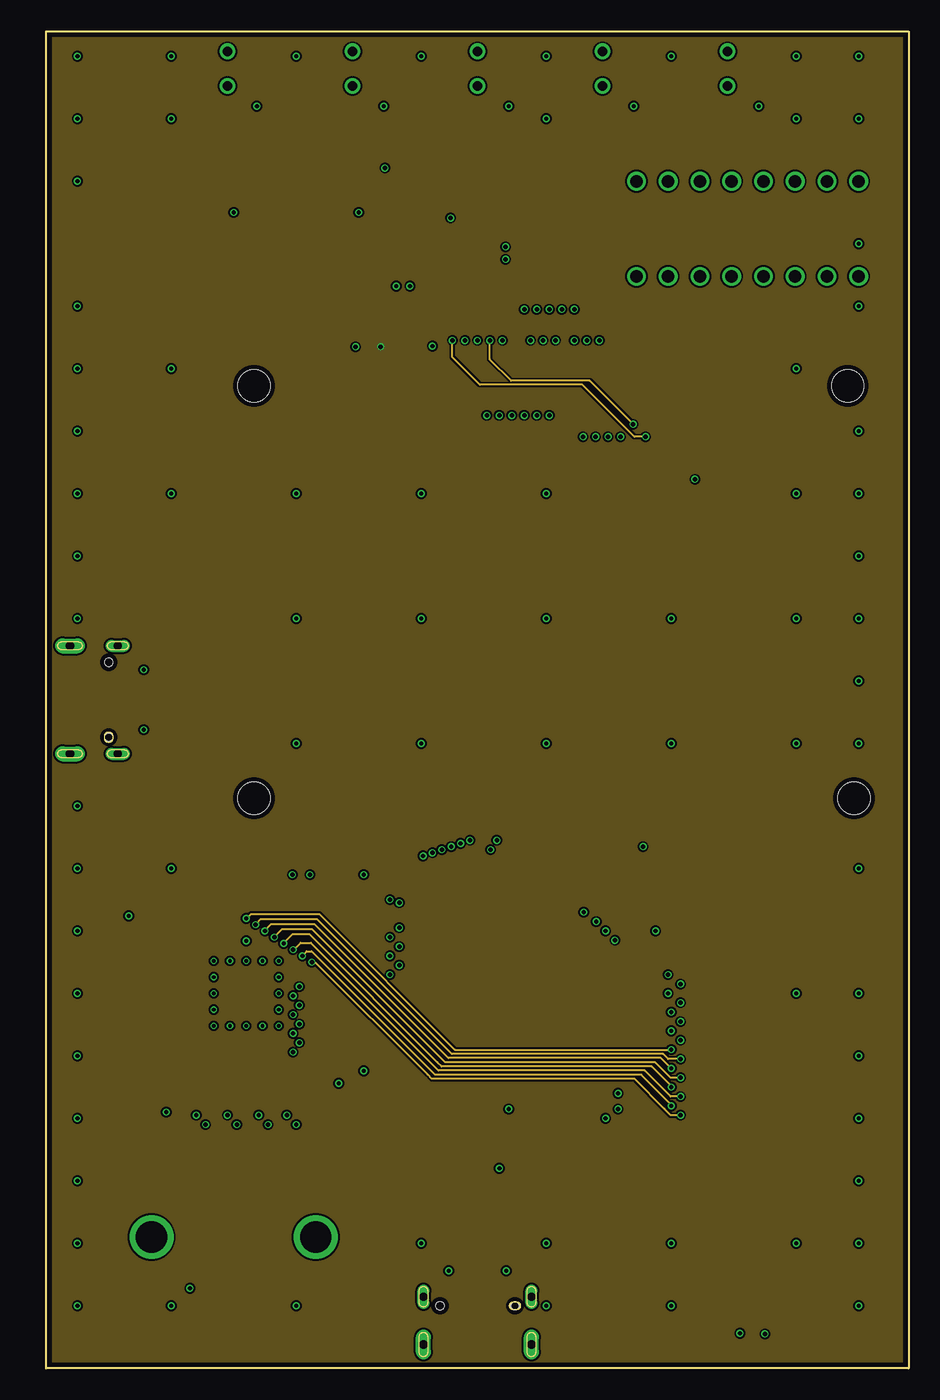
[diagram p7: board, inner layer Route15]
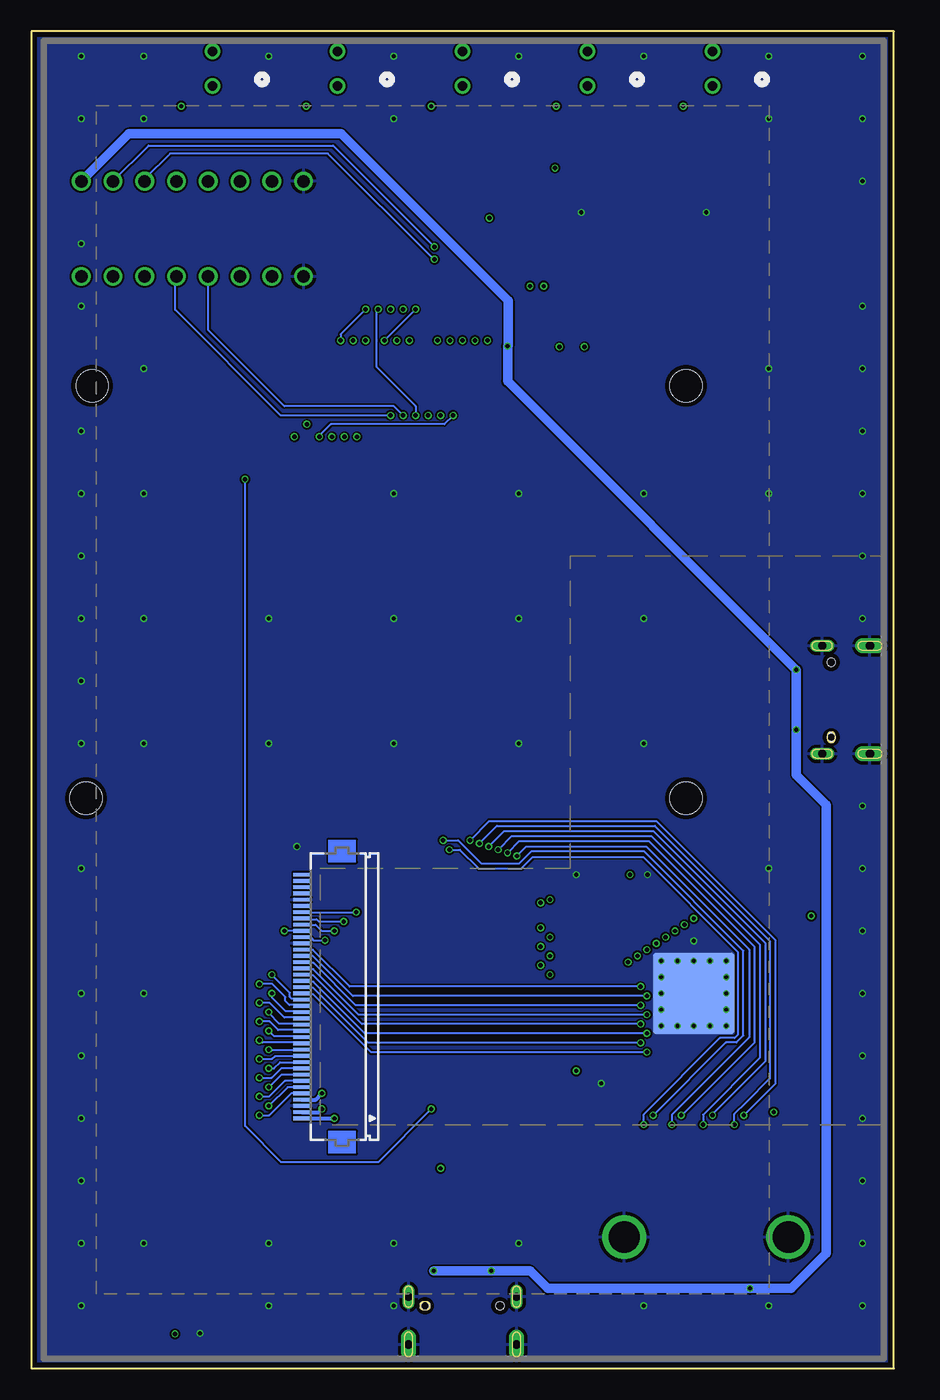
[diagram p8: board, bottom side, seen from below]

Size 69 x 107 mm. Coordinates in mm from the lower left corner, seen from the top.
Outline: 0,0 0,107 69,107 69,0 0,0
Copper layers (1*2+15*16): Top 0.0356mm / dielectric 0.2mm / Route2 0.0356mm / dielectric 0.15mm / Route15 0.0356mm / dielectric 0.2mm / Bottom 0.0356mm
Design rules "LaenPCBOrder-4layer *": minimum track width 6mil, minimum drill 10mil, track to track 6mil, track to pad 6mil, pad to pad 6mil, via to via 6mil, smd to smd 6mil, copper to edge 15mil, drill to drill 6mil, minimum pad ring 4mil, minimum via ring 4mil, stop-mask expansion 4mil, vias tented up to drill 25mil, thermal gap 10mil

### Footprints (pad centres in the part's own frame; a part is rotated, then mirrored left to right if it is on the bottom)
JAE_DX07S016JA1R1500 = smd 0.52 x 1: 1 -3.1,1.1; 2 -2.35,1.1; 11 2.35,1.1; 12 3.1,1.1 | smd 0.27 x 1: 3 -1.75,1.1; 4 -1.25,1.1; 5 -0.75,1.1; 6 -0.25,1.1; 7 0.25,1.1; 8 0.75,1.1; 9 1.25,1.1; 10 1.75,1.1 | smd 1 x 2: S1 -1.4,-3.1; S2 1.4,-3.1 | drill 0.65 long: S3 -4.32,0.725; S4 4.32,0.725 | drill 0.65 pad 1.2 long: S5 -4.32,-3.1; S6 4.32,-3.1 | hole 0.6: 3,0 | hole 0.63: 3,0; -3,0
BATTCON_12MM = smd 8 x 8: GND 0,0 | smd 3.175 x 3.175: PWR@1 -7.874,0; PWR@2 7.874,0
EIA3216 = smd 1.4 x 1.6: + 1.4,0; - -1.4,0
0603 = smd 1.1 x 1: 1 -0.85,0; 2 0.85,0
SOD323 = smd 0.625 x 0.83: A 1.113,0; K -1.113,0
MOLEX_MICRO_SD_104031 = smd 0.85 x 1.1: 1 3.105,0.55; 2 2.005,0.55; 3 0.905,0.55; 4 -0.195,0.55; 5 -1.295,0.55; 6 -2.395,0.55; 7 -3.495,0.55 | smd 0.75 x 1.1: 8 -4.545,0.55 | smd 1.27 x 0.635: CD1 6,10; CD2 6,7 | smd 1.17 x 1.8: SH@1 -5.755,0.9 | smd 1.55 x 1.35: SH@2 5.565,0.675 | smd 1.9 x 1.35: SH@3 -3.73,11.075; SH@4 2.24,11.075
SCREW_TERMINAL_8POS = drill 1: P$1 0,0; P$2 0,-2.54; P$3 0,-5.08; P$4 0,-7.62; P$5 0,-10.16; P$6 0,-12.7; P$7 0,-15.24; P$8 0,-17.78
INDUCTOR_SMD_4X4MM = smd 1.5 x 3.6: 1 -1.525,0; 2 1.525,0
RPI-CM4 = smd 0.2 x 0.7: 1 34.8,38.54; 2 34.8,35.46; 3 34.4,38.54; 4 34.4,35.46; 5 34,38.54; 6 34,35.46; 7 33.6,38.54; 8 33.6,35.46; 9 33.2,38.54; 10 33.2,35.46; 11 32.8,38.54; 12 32.8,35.46; 13 32.4,38.54; 14 32.4,35.46; 15 32,38.54; 16 32,35.46; 17 31.6,38.54; 18 31.6,35.46; 19 31.2,38.54; 20 31.2,35.46; 21 30.8,38.54; 22 30.8,35.46; 23 30.4,38.54; 24 30.4,35.46; 25 30,38.54; 26 30,35.46; 27 29.6,38.54; 28 29.6,35.46; 29 29.2,38.54; 30 29.2,35.46; 31 28.8,38.54; 32 28.8,35.46; 33 28.4,38.54; 34 28.4,35.46; 35 28,38.54; 36 28,35.46; 37 27.6,38.54; 38 27.6,35.46; 39 27.2,38.54; 40 27.2,35.46; 41 26.8,38.54; 42 26.8,35.46; 43 26.4,38.54; 44 26.4,35.46; 45 26,38.54; 46 26,35.46; 47 25.6,38.54; 48 25.6,35.46; 49 25.2,38.54; 50 25.2,35.46; 51 24.8,38.54; 52 24.8,35.46; 53 24.4,38.54; 54 24.4,35.46; 55 24,38.54; 56 24,35.46; 57 23.6,38.54; 58 23.6,35.46; 59 23.2,38.54; 60 23.2,35.46; 61 22.8,38.54; 62 22.8,35.46; 63 22.4,38.54; 64 22.4,35.46; 65 22,38.54; 66 22,35.46; 67 21.6,38.54; 68 21.6,35.46; 69 21.2,38.54; 70 21.2,35.46; 71 20.8,38.54; 72 20.8,35.46; 73 20.4,38.54; 74 20.4,35.46; 75 20,38.54; 76 20,35.46; 77 19.6,38.54; 78 19.6,35.46; 79 19.2,38.54; 80 19.2,35.46; 81 18.8,38.54; 82 18.8,35.46; 83 18.4,38.54; 84 18.4,35.46; 85 18,38.54; 86 18,35.46; 87 17.6,38.54; 88 17.6,35.46; 89 17.2,38.54; 90 17.2,35.46; 91 16.8,38.54; 92 16.8,35.46; 93 16.4,38.54; 94 16.4,35.46; 95 16,38.54; 96 16,35.46; 97 15.6,38.54; 98 15.6,35.46; 99 15.2,38.54; 100 15.2,35.46; 101 34.8,4.54; 102 34.8,1.46; 103 34.4,4.54; 104 34.4,1.46; 105 34,4.54; 106 34,1.46; 107 33.6,4.54; 108 33.6,1.46; 109 33.2,4.54; 110 33.2,1.46; 111 32.8,4.54; 112 32.8,1.46; 113 32.4,4.54; 114 32.4,1.46; 115 32,4.54; 116 32,1.46; 117 31.6,4.54; 118 31.6,1.46; 119 31.2,4.54; 120 31.2,1.46; 121 30.8,4.54; 122 30.8,1.46; 123 30.4,4.54; 124 30.4,1.46; 125 30,4.54; 126 30,1.46; 127 29.6,4.54; 128 29.6,1.46; 129 29.2,4.54; 130 29.2,1.46; 131 28.8,4.54; 132 28.8,1.46; 133 28.4,4.54; 134 28.4,1.46; 135 28,4.54; 136 28,1.46; 137 27.6,4.54; 138 27.6,1.46; 139 27.2,4.54; 140 27.2,1.46; 141 26.8,4.54; 142 26.8,1.46; 143 26.4,4.54; 144 26.4,1.46; 145 26,4.54; 146 26,1.46; 147 25.6,4.54; 148 25.6,1.46; 149 25.2,4.54; 150 25.2,1.46; 151 24.8,4.54; 152 24.8,1.46; 153 24.4,4.54; 154 24.4,1.46; 155 24,4.54; 156 24,1.46; 157 23.6,4.54; 158 23.6,1.46; 159 23.2,4.54; 160 23.2,1.46; 161 22.8,4.54; 162 22.8,1.46; 163 22.4,4.54; 164 22.4,1.46; 165 22,4.54; 166 22,1.46; 167 21.6,4.54; 168 21.6,1.46; 169 21.2,4.54; 170 21.2,1.46; 171 20.8,4.54; 172 20.8,1.46; 173 20.4,4.54; 174 20.4,1.46; 175 20,4.54; 176 20,1.46; 177 19.6,4.54; 178 19.6,1.46; 179 19.2,4.54; 180 19.2,1.46; 181 18.8,4.54; 182 18.8,1.46; 183 18.4,4.54; 184 18.4,1.46; 185 18,4.54; 186 18,1.46; 187 17.6,4.54; 188 17.6,1.46; 189 17.2,4.54; 190 17.2,1.46; 191 16.8,4.54; 192 16.8,1.46; 193 16.4,4.54; 194 16.4,1.46; 195 16,4.54; 196 16,1.46; 197 15.6,4.54; 198 15.6,1.46; 199 15.2,4.54; 200 15.2,1.46 | hole 2.55: 3.5,3.5; 3.5,36.5; 51,36.5; 51.5,3.5
TL1014BF160QG_EWI = smd 0.838 x 0.991: 1 2.8,1.348; 2 2.8,-0.352; 3 -2.8,1.348; 4 -2.8,-0.352 | drill 0.762 pad 1.27: 5 0,1.88; 6 0,-0.889
TQFP100_POWER_LITE = smd 1.6 x 0.3: 1 -7.6,6; 2 -7.6,5.5; 3 -7.6,5; 4 -7.6,4.5; 5 -7.6,4; 6 -7.6,3.5; 7 -7.6,3; 8 -7.6,2.5; 9 -7.6,2; 10 -7.6,1.5; 11 -7.6,1; 12 -7.6,0.5; 13 -7.6,0; 14 -7.6,-0.5; 15 -7.6,-1; 16 -7.6,-1.5; 17 -7.6,-2; 18 -7.6,-2.5; 19 -7.6,-3; 20 -7.6,-3.5; 21 -7.6,-4; 22 -7.6,-4.5; 23 -7.6,-5; 24 -7.6,-5.5; 25 -7.6,-6; 51 7.6,-6; 52 7.6,-5.5; 53 7.6,-5; 54 7.6,-4.5; 55 7.6,-4; 56 7.6,-3.5; 57 7.6,-3; 58 7.6,-2.5; 59 7.6,-2; 60 7.6,-1.5; 61 7.6,-1; 62 7.6,-0.5; 63 7.6,0; 64 7.6,0.5; 65 7.6,1; 66 7.6,1.5; 67 7.6,2; 68 7.6,2.5; 69 7.6,3; 70 7.6,3.5; 71 7.6,4; 72 7.6,4.5; 73 7.6,5; 74 7.6,5.5; 75 7.6,6 | smd 0.3 x 1.6: 26 -6,-7.6; 27 -5.5,-7.6; 28 -5,-7.6; 29 -4.5,-7.6; 30 -4,-7.6; 31 -3.5,-7.6; 32 -3,-7.6; 33 -2.5,-7.6; 34 -2,-7.6; 35 -1.5,-7.6; 36 -1,-7.6; 37 -0.5,-7.6; 38 0,-7.6; 39 0.5,-7.6; 40 1,-7.6; 41 1.5,-7.6; 42 2,-7.6; 43 2.5,-7.6; 44 3,-7.6; 45 3.5,-7.6; 46 4,-7.6; 47 4.5,-7.6; 48 5,-7.6; 49 5.5,-7.6; 50 6,-7.6; 76 6,7.6; 77 5.5,7.6; 78 5,7.6; 79 4.5,7.6; 80 4,7.6; 81 3.5,7.6; 82 3,7.6; 83 2.5,7.6; 84 2,7.6; 85 1.5,7.6; 86 1,7.6; 87 0.5,7.6; 88 0,7.6; 89 -0.5,7.6; 90 -1,7.6; 91 -1.5,7.6; 92 -2,7.6; 93 -2.5,7.6; 94 -3,7.6; 95 -3.5,7.6; 96 -4,7.6; 97 -4.5,7.6; 98 -5,7.6; 99 -5.5,7.6; 100 -6,7.6 | drill 0.3: TH21 -2.6,2.6; TH22 -1.3,2.6; TH23 0,2.6; TH24 1.3,2.6; TH25 2.6,2.6; TH30 -2.6,1.3; TH34 2.6,1.3; TH39 -2.6,0; TH43 2.6,0; TH48 -2.6,-1.3; TH52 2.6,-1.3; TH57 -2.6,-2.6; TH58 -1.3,-2.6; TH59 0,-2.6; TH60 1.3,-2.6; TH61 2.6,-2.6 | smd 6.5 x 6.5: THA 0,0 | smd 6.5 x 6.5 bottom: THB 0,0
HIROSE_FFC40_FH12-40S-0.5SH = smd 0.3 x 1.3: 1 -9.75,3.25; 2 -9.25,3.25; 3 -8.75,3.25; 4 -8.25,3.25; 5 -7.75,3.25; 6 -7.25,3.25; 7 -6.75,3.25; 8 -6.25,3.25; 9 -5.75,3.25; 10 -5.25,3.25; 11 -4.75,3.25; 12 -4.25,3.25; 13 -3.75,3.25; 14 -3.25,3.25; 15 -2.75,3.25; 16 -2.25,3.25; 17 -1.75,3.25; 18 -1.25,3.25; 19 -0.75,3.25; 20 -0.25,3.25; 21 0.25,3.25; 22 0.75,3.25; 23 1.25,3.25; 24 1.75,3.25; 25 2.25,3.25; 26 2.75,3.25; 27 3.25,3.25; 28 3.75,3.25; 29 4.25,3.25; 30 4.75,3.25; 31 5.25,3.25; 32 5.75,3.25; 33 6.25,3.25; 34 6.75,3.25; 35 7.25,3.25; 36 7.75,3.25; 37 8.25,3.25; 38 8.75,3.25; 39 9.25,3.25; 40 9.75,3.25
SOT353-5 = smd 0.4 x 0.9: 1 -0.65,-1.1; 2 0,-1.1; 3 0.65,-1.1; 4 0.65,1.1; 5 -0.65,1.1
SOIC16W = smd 0.55 x 2: 1 -4.445,-4.685; 2 -3.175,-4.685; 3 -1.905,-4.685; 4 -0.635,-4.685; 5 0.635,-4.685; 6 1.905,-4.685; 7 3.175,-4.685; 8 4.445,-4.685; 9 4.445,4.685; 10 3.175,4.685; 11 1.905,4.685; 12 0.635,4.685; 13 -0.635,4.685; 14 -1.905,4.685; 15 -3.175,4.685; 16 -4.445,4.685
FCI_USB_A_87583 = smd 1.12 x 2.88: D+ 1,3.58; D- -1,3.58; GND 3.5,3.58; VBUS -3.5,3.58 | drill 2.5 pad 3: SH@1 -6.57,0; SH@2 6.57,0

### Placement (x,y rotation side)
34  34.5,5 0 top
BT1  6.8,90.62 90 top
C6  46.75,16.75 90 top
C7  23,39.8 0 top
C9  31.35,96.05 0 top
C11  27.25,84 90 top
C12  25.38,84 90 top
C13  30.75,84 90 top
C15  7.6,21.1 180 top
C16  24.8,21.8 270 top
C17  7.3,38.2 90 top
C21  23.62,84 90 top
C22  22,84 90 top
D1  42.7,19.55 180 top
FRAME1  13.3,-22.9 0 top  (outside the outline)
FRAME2  13.3,-31.6 0 top  (outside the outline)
FRAME3  13.3,-40.3 0 top  (outside the outline)
FRAME4  13.3,-14.2 0 top  (outside the outline)
FRAME5  13.3,-49 0 top  (outside the outline)
J1  57.75,0.75 0 top
J5  65,95 270 top
J6  65,87.38 270 top
J7  5,53.5 270 top
L3  39.92,16.5 0 top
R1  33.6,10.05 270 top
R2  35.2,10.05 270 top
R3  10.3,52.7 180 top
R4  10.35,54.45 180 top
R9  19.5,84 270 top
R10  17.75,84 270 top
R11  31.35,93.3 180 top
R12  31.35,90.8 180 top
R13  42.17,22.07 0 top
RBKL_PWM  36.25,18.25 90 top
RPI-CM1  13.12,42.12 0 top
RSW1  54.75,101 180 top
RSW2  44.75,101 180 top
RSW3  34.75,101 180 top
RSW4  24.75,101 180 top
RSW5  14.75,101 180 top
SW1  54.5,104.5 180 top
SW2  44.5,104.5 180 top
SW3  34.5,104.5 180 top
SW4  24.5,104.5 180 top
SW5  14.5,104.5 180 top
U2  16,30 180 top
U3  44.12,29.75 90 bottom
U5  39.27,20.18 90 top
U10  23.98,93.3 180 top
U$4  36.88,53.5 90 bottom
USB_A  15,10.5 0 top

### Tracks (layer width: path | path; a pad name or v marks a point on that pad's centre or on a via)
B0  (via drill 0.35)
  Top 0.152: U2.10 23.53,28.43 22.68,28.43 21.56,27.3 21.56,26.57 20.29,25.3 v19.75,25.3
  Bottom 0.152: v19.75,25.3 41.81,25.3 46.44,29.93 47.31,29.93 U3.21
B1  (via drill 0.35)
  Top 0.152: U2.11 23.53,28.93 22.68,28.93 21.2,27.45 21.2,26.97 20.28,26.05 v20.25,26.05
  Bottom 0.152: v20.25,26.05 42.06,26.05 46.44,30.43 47.31,30.43 U3.22
B2  (via drill 0.35)
  Top 0.152: U2.12 23.53,29.43 22.67,29.43 20.81,27.57 20.81,27.32 20.29,26.8 v19.75,26.8
  Bottom 0.152: v19.75,26.8 42.3,26.8 46.43,30.93 47.31,30.93 U3.23
B3  (via drill 0.35)
  Top 0.152: U2.13 23.53,29.93 22.67,29.93 20.29,27.55 v20.25,27.55
  Bottom 0.152: v20.25,27.55 42.55,27.55 46.43,31.43 47.31,31.43 U3.24
B4  (via drill 0.35)
  Top 0.152: U2.14 23.53,30.43 22.66,30.43 20.49,28.26 19.79,28.26 v19.75,28.3
  Bottom 0.152: v19.75,28.3 42.79,28.3 46.42,31.93 47.31,31.93 U3.25
B5  (via drill 0.35)
  Top 0.152: U2.15 23.53,30.93 22.53,30.93 20.65,29.05 v20.25,29.05
  Bottom 0.152: v20.25,29.05 43.03,29.05 46.41,32.43 47.31,32.43 U3.26
B6  (via drill 0.35)
  Top 0.152: U2.16 23.53,31.43 22.43,31.43 20.8,29.8 v19.75,29.8
  Bottom 0.152: v19.75,29.8 43.28,29.8 46.51,33.03 47.34,33.03 U3.27
B7  (via drill 0.35)
  Top 0.152: U2.17 22.4,32 20.95,30.55 v20.25,30.55
  Bottom 0.152: v20.25,30.55 43.52,30.55 46.47,33.5 U3.28
BKL_LED_A  (via drill 0.35)
  Top 0.305: D1.K 44.02,19.34 45.13,19.34 45.77,19.98 45.77,20.73 v45.75,20.75 45.75,19.15 C6.+
  Bottom 0.305: U3.2 46,20.5 v45.75,20.75
BKL_LED_K  (via drill 0.35)
  Top 0.305: U5.3 43.92,20.82 v44.75,20 43.02,21.73 R13.2
  Bottom 0.305: U3.1 v44.75,20
BKL_PWM  (via drill 0.35)
  Top 0.152: RPI-CM1.27 42.73,79.67 43.15,79.25 47.8,79.25 51.9,75.15 v51.9,71.15 | U5.4 37.08,20.82 v37,20.75 36.25,20 RBKL_PWM.2
  Bottom 0.152: v37,20.75 41.25,16.5 49,16.5 51.9,19.4 v51.9,71.15
BTN_SW1  (via drill 0.35)
  Top 0.152: SW1.1 51.7,101 | 51.7,101 51.7,100.95 50.9,100.15 41.45,100.15 39.75,98.45 39.75,87.25 v42.25,84.75 | RPI-CM1.25 43.12,81.12 v44.25,82.25 | RSW1.2 51.7,101
  Bottom 0.152: v42.25,84.75 44.25,82.75 v44.25,82.25
BTN_SW2  (via drill 0.35)
  Top 0.152: SW2.1 41.7,100.9 | 41.7,100.9 39.35,98.55 39.35,86.65 v41.25,84.75 | RSW2.2 43.85,101 43.75,100.9 41.7,100.9 | RPI-CM1.46 39.09,77.55 39.09,77.12 38.25,76.28 v38.25,76.25
  Bottom 0.152: v41.25,84.75 41.4,84.61 41.4,80.14 38.25,77 v38.25,76.25
BTN_SW3  (via drill 0.35)
  Top 0.152: 33.9,100.11 33.09,100.11 31.7,101.5 SW3.1 | 33.9,100.11 37.37,100.11 38.98,98.5 38.98,86.02 v40.25,84.75 40.25,83.75 v38.75,82.25 38.73,82.22 RPI-CM1.47 | RSW3.2 33.9,100.11
BTN_SW4  (via drill 0.35)
  Top 0.152: SW4.1 21.7,101.45 23.37,99.78 24,99.78 | 24,99.78 37.19,99.78 38.65,98.32 38.65,85.23 39.13,84.75 v39.25,84.75 | RPI-CM1.45 39.12,81.62 v39.75,82.25 | RSW4.2 24,100.9 24,99.78
  Route2 0.152: v39.25,84.75 39.25,82.75 v39.75,82.25
BTN_SW5  (via drill 0.35)
  Top 0.152: SW5.1 11.7,101.45 13.7,99.45 14,99.45 | 14,99.45 37.05,99.45 38.25,98.25 v38.25,84.75 | RPI-CM1.41 39.92,81.42 v40.75,82.25 | RSW5.2 14,100.9 14,99.45
  Bottom 0.152: v38.25,84.75 v40.75,82.25
DE  (via drill 0.35)
  Top 0.152: v43,36.5 43,36.8 40.2,39.6 29.65,39.6 28.28,40.98 14.53,40.98 12.07,38.52 12,38.45 U2.46
  Bottom 0.152: U3.34 v43,36.5
G0  (via drill 0.35)
  Top 0.152: U2.20 25.5,33.5 v27.5,31.5
  Route2 0.152: v50.75,26.25 v50.74,26.24 34.57,26.24 29.31,31.5 v27.5,31.5
  Bottom 0.152: U3.13 47.44,26.07 50.49,26.07 50.67,26.25 v50.75,26.25
G1  (via drill 0.35)
  Top 0.152: U2.21 25.71,34 27.47,32.24 v28.24,32.24 v28.25,32.25
  Route2 0.152: v28.25,32.25 29.15,32.25 34.4,27 v50,27
  Bottom 0.152: U3.14 47.44,26.57 49.54,26.57 49.97,27 v50,27
G2  (via drill 0.35)
  Top 0.152: v27.5,33 26,34.5 U2.22
  Route2 0.152: v50.75,27.75 v50.74,27.74 34.17,27.74 28.91,33 v27.5,33
  Bottom 0.152: U3.15 47.44,27.07 49.24,27.07 49.92,27.75 v50.75,27.75
G3  (via drill 0.35)
  Top 0.152: U2.23 26.2,35 27.45,33.75 v28.25,33.75
  Route2 0.152: v28.25,33.75 28.75,33.75 34,28.5 v50,28.5
  Bottom 0.152: U3.16 47.44,27.57 49.14,27.57 50,28.43 v50,28.5
G4  (via drill 0.35)
  Top 0.152: U2.24 26.5,35.5 v27.5,34.5
  Route2 0.152: v27.5,34.5 28.6,34.5 33.84,29.26 v50.74,29.26 v50.75,29.25
  Bottom 0.152: U3.17 47.44,28.07 48.74,28.07 49.92,29.25 v50.75,29.25
G5  (via drill 0.35)
  Top 0.152: U2.25 26.64,36.01 27.4,35.25 v28.25,35.25
  Route2 0.152: v28.25,35.25 28.5,35.25 33.75,30 v49.75,30
  Bottom 0.152: U3.18 47.44,28.57 48.64,28.57 49.75,29.68 v49.75,30
G6  (via drill 0.35)
  Top 0.152: v27.5,37.5 26.9,36.9 22.7,36.9 U2.26
  Route2 0.152: v27.5,37.5 27.5,36.8 33.59,30.71 50.71,30.71 v50.75,30.75
  Bottom 0.152: U3.19 47.44,29.07 48.35,29.07 48.66,29.39 48.66,29.7 49.71,30.75 v50.75,30.75
G7  (via drill 0.35)
  Top 0.152: U2.27 21.57,37.53 21.57,36.68 21.73,36.52 27.52,36.52 v28.25,37.25
  Route2 0.152: v28.25,37.25 28.25,36.65 33.4,31.5 v49.75,31.5
  Bottom 0.152: U3.20 47.44,29.57 48.14,29.57 48.31,29.73 48.31,30.06 v49.75,31.5
GND  (via drill 0.35)
  other vias: 25.4,39.5 19.7,39.5 16,34.2 23.4,22.8 47.75,41.75 55.5,2.8 10,80 10,70 20,70 30,70 40,70 60,70 60,80 60,60 50,60 40,60 30,60 20,60 20,50 30,50 40,50 50,50 60,50 60,30 50,10 60,10 40,10 30,10 10,40 10,100 60,100 40,100 2.5,105 2.5,100 2.5,95 2.5,85 2.5,80 2.5,75 2.5,70 2.5,65 2.5,60 2.5,45 2.5,40 2.5,35 2.5,30 2.5,25 2.5,20 2.5,15 2.5,10 2.5,5 65,105 65,100 65,90 65,85 65,75 65,70 65,65 65,60 65,55 65,50 65,40 65,30 65,25 65,20 65,15 65,10 65,5 20,5 50,5 10,105 15,92.5 25,92.5 60,105 50,105 40,105 30,105 20,105 10,5 40,5
  pour Top (rank 2): 72,109 72,-3 -3,-3 -3,109
  pour Bottom (rank 2): 73.2,110 -3.9,110 -3.9,-4.38 73.2,-4.38
GPIO7  (via drill 0.35)
  Top 0.152: RPI-CM1.37 40.76,80.7 40.76,81.13 40.91,81.28 42.25,81.28 43.22,82.25 v43.25,82.25 43.25,83.05 45.5,85.3 60.38,85.3 J6.P$2
GPIO8  (via drill 0.35)
  Top 0.152: RPI-CM1.39 40.33,81.16 40.78,81.61 41.62,81.61 v42.25,82.25 42.25,82.75 45.2,85.7 58.24,85.7 J6.P$3
GPIO9  (via drill 0.35)
  Top 0.152: v40.25,76.25 40.33,76.33 RPI-CM1.40
  Bottom 0.152: v40.25,76.25 49.03,76.25 57.49,84.71 57.49,87.27 J6.P$4
GPIO10  (via drill 0.35)
  Top 0.152: v39.25,76.25 39.52,76.53 RPI-CM1.44
  Bottom 0.152: v39.25,76.25 40,77 48.75,77 54.84,83.09 J6.P$5
HSYNC  (via drill 0.35)
  Top 0.152: v44.75,35 44.81,35.06 44.81,36.04 40.53,40.31 30,40.31 28.52,41.8 14.29,41.8 11,38.51 U2.48
  Bottom 0.152: U3.32 46.25,35.5 45.75,35 v44.75,35
L_BKL
  Top 0.305: U5.1 41.56,19.52 D1.A 41.59,16.64 L3.2
N$1
  Top 0.152: R2.2 35.75,8.65 34.9
N$2
  Top 0.152: R1.2 32.75,8.35 34.3
N$3
  Top 0.152: R3.2 9,52.25 J7.9
N$4
  Top 0.152: R4.2 9.5,54.5 8.75,55.25 J7.3
N$8  (via drill 0.35)
  Top 0.152: v30.15,41 30.15,41.71 31.52,43.09 RPI-CM1.184 | v17.75,19.5 17.75,20.25 17.5,20.5 U2.91
  Bottom 0.152: v30.15,41 29.4,41.75 19.8,41.75 11.57,33.51 11.57,26.48 17.75,20.3 v17.75,19.5
N$10  (via drill 0.35)
  Top 0.152: RPI-CM1.182 31.93,42.88 30.9,41.86 v30.9,41.25 | v17,20.25 U2.90
  Bottom 0.152: v30.9,41.25 29.95,42.2 19.6,42.2 11.15,33.75 11.15,26.06 16.96,20.25 v17,20.25
N$11  (via drill 0.35)
  Top 0.152: RPI-CM1.178 32.73,43.09 31.52,41.88 31.52,41.62 v31.65,41.5 | U2.86 15.07,22.33 15.07,20.48 15.25,20.3 v15.25,19.5
  Bottom 0.152: v31.65,41.5 30.55,42.6 19.4,42.6 10.72,33.92 10.72,24.82 15.25,20.3 v15.25,19.5
N$12  (via drill 0.35)
  Top 0.152: RPI-CM1.176 33.12,42.88 32.42,42.19 32.42,41.77 v32.4,41.75 | v14.5,20.25 U2.85
  Bottom 0.152: v32.4,41.75 31.15,43 19.25,43 10.3,34.05 10.3,24.55 14.5,20.36 v14.5,20.25
N$13  (via drill 0.35)
  Top 0.152: RPI-CM1.172 33.92,43.09 33.12,42.28 33.12,42.02 v33.15,42 | v12.75,19.5 12.75,20.3 12.57,20.48 12.5,20.55 12.5,21.35 U2.81
  Bottom 0.152: v33.15,42 31.75,43.4 19.11,43.4 9.9,34.2 9.9,23.2 11.8,21.3 12.75,20.35 v12.75,19.5
N$14  (via drill 0.35)
  Top 0.152: RPI-CM1.170 34.34,43.57 34.34,42.58 34.01,42.25 v33.9,42.25 | v12,20.25 U2.80
  Bottom 0.152: v33.9,42.25 32.35,43.8 19,43.8 9.5,34.3 9.5,22.75 v12,20.25
N$15  (via drill 0.35)
  Top 0.152: v35.55,41.5 35.12,41.92 RPI-CM1.166 | U2.94 19.07,22.33 19.07,21.48 20,20.55 v20,19.5
  Bottom 0.152: v35.55,41.5 34.7,41.5 33.2,40 29.8,40 28.9,40.9 20.05,40.9 12.47,33.31 12.47,26.69 12.73,26.43 13.91,26.43 20,20.34 v20,19.5
N$16  (via drill 0.35)
  Top 0.152: RPI-CM1.164 35.52,42.77 v36.05,42.25 | v19.25,20.25 18.5,21 U2.93
  Bottom 0.152: v19.25,20.25 13.43,26.07 12.59,26.07 12.03,26.63 12.03,33.42 19.96,41.35 29.01,41.35 29.97,40.39 32.99,40.39 34.85,42.25 v36.05,42.25
PCLK  (via drill 0.35)
  Top 0.152: v45.5,34.25 44.44,34.25 39.51,39.18 29.5,39.18 28.06,40.62 14.77,40.62 13,38.85 U2.44
  Bottom 0.152: U3.30 47.31,34.43 46.61,34.43 46.43,34.25 v45.5,34.25
R0  (via drill 0.35)
  Top 0.152: U2.30 20.07,37.53 20.07,35.28 21.25,34.1 v21.25,32.5
  Route15 0.152: v21.25,32.5 21.51,32.5 30.51,23.51 30.85,23.16 47.07,23.16 49.45,20.78 49.45,20.77 49.98,20.25 v50.75,20.25
  Bottom 0.152: v50.75,20.25 v50.74,20.24 49.97,20.24 48.21,22 U3.5
R1  (via drill 0.35)
  Top 0.152: U2.31 19.57,37.53 19.57,35.18 20.5,34.25 v20.5,33
  Route15 0.152: v20.5,33 20.5,33.04 20.83,33.37 21.23,33.37 30.55,24.05 31.11,23.5 47.6,23.5 50,21.1 v50,21
  Bottom 0.152: U3.6 48.5,22.5 v50,21
R2  (via drill 0.35)
  Top 0.152: U2.32 19.07,37.53 19.07,35.08 19.75,34.4 v19.75,33.5
  Route15 0.152: v19.75,33.5 19.81,33.5 20.36,34.04 21.17,34.04 31.06,24.16 31.38,23.83 47.87,23.83 49.95,21.75 v50.75,21.75
  Bottom 0.152: v50.75,21.75 v50.74,21.74 49.97,21.74 48.71,23 U3.7
R3  (via drill 0.35)
  Top 0.152: U2.33 18.57,37.53 18.57,34.98 19,34.55 v19,34
  Route15 0.152: v19,34 19,34.04 19.72,34.76 21.04,34.76 31.3,24.5 31.64,24.16 48.44,24.16 50,22.6 v50,22.5
  Bottom 0.152: U3.8 49,23.5 v50,22.5
R4  (via drill 0.35)
  Top 0.152: U2.34 17.97,37.57 17.97,35.38 18.15,35.2 18.15,34.6 v18.25,34.5
  Route15 0.152: v18.25,34.5 18.25,34.54 18.87,35.16 21.25,35.16 31.66,24.76 31.92,24.49 48.71,24.49 49.95,23.25 v50.75,23.25
  Bottom 0.152: U3.9 49.01,24 49.77,23.24 v50.74,23.24 v50.75,23.25
R5  (via drill 0.35)
  Top 0.152: U2.35 17.57,37.53 17.57,35.07 v17.5,35
  Route15 0.152: v17.5,35 17.5,35.04 18.02,35.56 21.44,35.56 31.85,25.15 32.18,24.82 49.18,24.82 v50,24
  Bottom 0.152: U3.10 49.1,24.5 49.6,24 v50,24
R6  (via drill 0.35)
  Top 0.152: U2.36 17.07,37.53 17.07,35.82 v16.75,35.5
  Route15 0.152: v16.75,35.5 16.75,35.54 17.17,35.96 21.65,35.96 32.26,25.36 32.46,25.16 49.34,25.16 49.75,24.75 v50.75,24.75
  Bottom 0.152: v50.75,24.75 49.75,24.75 49.5,25 U3.11
R7  (via drill 0.35)
  Top 0.152: U2.37 16.57,37.53 16.57,36.57 v16,36
  Route15 0.152: v16,36 16.06,36 16.42,36.36 21.84,36.36 32.7,25.5 v50,25.5
  Bottom 0.152: v50,25.5 U3.12
RTC_VBAT
  Top 0.305: BT1.PWR@1 12.7,82.75 16.88,86.92 25.29,86.92 25.86,87.5 25.86,88.6 U10.14
RXD0  (via drill 0.35)
  Top 0.152: v36.75,89.75 36.91,89.59 37.54,88.56 37.54,81.85 37.92,81.47 RPI-CM1.51
  Bottom 0.152: v36.75,89.75 44.85,97.85 59.61,97.85 J5.P$2
SCDT  (via drill 0.35)
  Top 0.152: v48.75,35 47.25,33.5 32.25,33.5 26.25,27.5 U2.8
  Bottom 0.152: U3.31 v48.75,35
SCL0
  Top 0.152: RPI-CM1.80 32.32,77.58 32.32,76.37 30.95,75 25.05,75 17.75,82.3 R10.2
SCL1  (via drill 0.35)
  Top 0.152: R12.2 30.25,90.55 29,90.55 28.35,89.9 28.35,88.69 U10.16 28.42,87.28 v29.1,86.6 | v37.25,76.25 37.25,77.03 37.16,77.12 37.16,77.55 RPI-CM1.56
  Route2 0.152: v29.1,86.6 29.1,86.5 31.75,83.85 31.75,80.05 34.63,77.17 36.31,77.17 v37.24,76.24 v37.25,76.25
SD_CLK  (via drill 0.35)
  Top 0.152: J1.5 56.45,62.15 44.9,73.7 44.9,74.5 v44.95,74.55 | RPI-CM1.57 36.73,82.03 v36.5,82.25
  Route2 0.152: v44.95,74.55 41.3,78.2 37.4,78.2 36.5,79.1 v36.5,82.25
SD_CMD  (via drill 0.35)
  Top 0.152: J1.3 58.66,2.94 56.8,4.8 56.8,62.27 45.95,73.12 v45.95,74.55 | RPI-CM1.62 35.89,77.55 35.89,77.12 35.25,76.48 v35.25,76.25
  Bottom 0.152: v45.95,74.55 45.95,74.62 45.03,75.55 35.95,75.55 v35.25,76.25
SD_DAT0  (via drill 0.35)
  Top 0.152: J1.7 54.26,2.69 56.03,4.46 56.03,62.07 43.95,74.15 v43.95,74.55 | v34.5,82.25 34.69,82.25 35.52,81.42 RPI-CM1.63
  Route2 0.152: v43.95,74.55 40.63,77.87 37.26,77.87 34.57,80.56 34.57,82.18 v34.5,82.25
SD_DAT1  (via drill 0.35)
  Top 0.152: J1.8 53.2,2.1 55.7,4.6 55.7,61.9 42.95,74.65 v42.95,74.55 | RPI-CM1.67 34.73,81.19 33.67,82.25 v33.5,82.25
  Route2 0.152: v42.95,74.55 39.96,77.54 37.12,77.54 33.44,81.22 33.44,82.19 v33.5,82.25
SD_DAT2  (via drill 0.35)
  Top 0.152: J1.1 60.85,1.73 57.46,5.12 57.46,62.6 47.95,72.11 v47.95,74.55 | v32.5,82.25 33.45,81.3 34.15,81.3 34.33,81.12 RPI-CM1.69
  Route15 0.152: v47.95,74.55 47.05,74.55 42.9,78.7 34.7,78.7 32.5,80.9 v32.5,82.25
SD_DAT3  (via drill 0.35)
  Top 0.152: J1.2 59.76,2.35 57.13,4.98 57.13,62.41 46.95,72.59 v46.95,75.55 | RPI-CM1.61 35.92,81.67 35.42,82.17 v35.5,82.25
  Route15 0.152: v46.95,75.55 43.47,79.03 37.2,79.03 35.5,80.73 v35.5,82.25
SDA0
  Top 0.152: RPI-CM1.82 31.97,77.54 31.97,76.48 30.84,75.36 25.14,75.36 19.5,81 R9.2
SDA1  (via drill 0.35)
  Top 0.152: R11.2 27.2,90 27.2,88.67 U10.15 27.15,87.45 v28,86.6 | v36.25,76.25 36.73,76.72 RPI-CM1.58
  Route2 0.152: v28,86.6 31.42,83.18 31.42,79.91 34.5,76.83 35.67,76.83 v36.25,76.25
TXD0  (via drill 0.35)
  Top 0.152: RPI-CM1.55 37.12,87.88 v36.75,88.75
  Bottom 0.152: v36.75,88.75 36.8,88.75 45.27,97.22 57.88,97.22 59.92,95.18 J5.P$3
USB_N
  Top 0.152: USB_A.D- 14,15.7 15,16.7 27.73,16.7 43.71,32.68 48.68,32.68 49.4,33.4 49.4,47.3 49.2,47.49 47.73,47.49 47.52,47.29 RPI-CM1.103
USB_P
  Top 0.152: USB_A.D+ 16,15.85 16.5,16.35 27.85,16.35 43.85,32.35 48.85,32.35 49.75,33.25 49.75,47.45 49.4,47.8 47.6,47.8 47.12,47.33 RPI-CM1.105
VCC_1V8  (via drill 0.35)
  Top 0.305: C11.1 27.3,83.1 27.3,81.75 | 27.3,81.75 27.3,77.05 27.85,76.5 30.3,76.5 30.6,76.8 | 27.3,81.75 v26.75,81.75
  pour Route15 (rank 2): 71,108 -1.65,108 -1.65,-1.88 71,-1.88
  pour Top (no thermals): 30.3,77.9 30.3,76.5 30.7,76.5 30.8,76.5 30.8,77.9
VCC_3V3  (via drill 0.35)
  Top 0.305: C16.1 24.8,23.8 | 24.8,23.8 24.8,25 | U2.7 24.4,27 24.8,26.6 24.8,26.2 | 24.8,26.2 24.8,25 | 19.5,23.36 19.3,23.56 16.21,23.56 16.02,23.37 | 19.5,23.36 19.7,23.56 20.3,23.56 20.5,23.36 U2.97 20.5,23.3 20.73,23.52 21.38,23.52 21.5,23.4 U2.99 | C17.1 7.24,37.29 7.24,36.2 | 7.24,36.2 7.24,33.2 7.45,32.99 U2.57 | U2.43 13.47,37.62 13.47,38.5 13.78,38.8 15.68,38.8 15.96,38.53 15.96,37.65 U2.38 16.05,37.65 16.05,38.53 16.32,38.8 20.51,38.8 | v25.4,23.8 24.8,23.8 | v21.1,39.5 21.1,40 | 21.1,40 20.9,40 20.51,39.61 20.51,38.8 | U2.3 24.8,25 | U2.6 24.5,26.5 24.8,26.2 | U2.95 19.5,23.36 | 16.02,23.37 15.84,23.56 14.25,23.56 14,23.3 U2.84 14,23.28 13.7,23.58 13.23,23.58 13.01,23.35 13.01,23.28 | U10.2 27.1,97.94 v27.1,96.05 C9.1 | R12.1 32.35,90.95 v32.35,92.05 32.45,92.15 32.45,93.05 R11.1 | v57.5,2.75 57.55,2.69 J1.4 | 25.38,81.75 25.38,78.03 27.5,75.9 30.6,75.9 31.4,76.7 | 25.38,81.75 C12.1 C21.1 C22.1 | 25.38,81.75 v24.75,81.75 | v16.85,101 RSW5.1 | RSW4.1 v27,101 | RSW3.1 v37,101 | RSW2.1 v47,101 | RSW1.1 v57,101 | 16.02,23.37 16.02,22.43 U2.88 | U2.82 13.01,23.28 | U2.57 | U2.57 9.3,32.99 9.56,32.74 9.56,28.28 9.28,28 U2.67 | C15.1 8.5,21.15 9.6,21.15 | 9.6,21.15 10.63,21.15 11,21.52 U2.78 10.99,23.28 11.22,23.5 12.78,23.5 13.01,23.28 | v9.6,20.5 9.6,21.15 | U2.18 22.63,32.5 22.44,32.68 22.44,33.56 20.5,35.5 U2.29 20.5,38.79 20.51,38.8 | v36.25,16 RBKL_PWM.1 | 21.1,40 21.95,40 C7.1 | v6.6,36.2 7.24,36.2
  Bottom 0.305: U3.4 46.25,21.5 v45.75,22
  pour Route2 (rank 2): 74,111 -5,111 -5,-5.38 74,-5.38
  pour Top (no thermals): 31.1,77.9 31.1,76.5 31.6,76.5 31.6,77.9
VCC_5V0  (via drill 0.35)
  Top 0.305: U5.5 38.15,19.5 38.15,16.75 L3.1 38.55,16.35 | C13.1 30.75,83.1 30.9,82.95 v30.9,81.8 | v7.8,55.9 7.75,55.85
  Top 0.508: 7.75,55.85 J7.2 | v7.8,51.1 6.15,51.1 J7.11 | v32.2,7.8 32.2,6.15 34.2 | v36.8,7.8 36.8,6.15 34.11
  Top 0.75: v36.8,7.8 38.55,9.55 38.55,16.35 | v11.5,6.4 USB_A.VBUS
  Bottom 0.75: v36.8,7.8 v32.2,7.8 29.1,7.8 27.7,6.4 v11.5,6.4 8.2,6.4 5.4,9.2 5.4,45.1 7.8,47.5 v7.8,51.1 v7.8,55.9 30.9,79 v30.9,81.8 30.85,81.85 30.85,85.45 44.2,98.8 61.2,98.8 J5.P$1
  pour Top (no thermals): 30.7,80.3 32.7,80.3 32.7,81.2 31.9,81.2 31.1,82 30.7,82
VSYNC  (via drill 0.35)
  Top 0.152: v44,35.75 44,36.34 40.38,39.96 29.8,39.96 28.4,41.36 14.4,41.36 11.47,38.42 11.47,37.63 U2.47
  Bottom 0.152: U3.33 47.31,35.93 46.18,35.93 45.99,35.75 v44,35.75

### Text on the board
tPlace: GND | TX | RX | 5VIN | WIRED / INSTALL | Realtime / clock | AUX I/O | GND | 10 | 9 | 8 | 7 | 3V3 | http://airball.aero/ | LCD backlight power | D1 | HDMI to PanelBus | Jeremy Cole and Ihab Awad
tNames: RTC Battery / 3V CR12xx / Insert "+" up! | Airball Display v2 | Designed by Jeremy Cole and Ihab Awad